# Altium project OZ440-SE100-CAR003.PrjPcb (part 2 of 3)

## Sheet OZ440-SE100-CAR003_sheet5.SchDoc
size A3
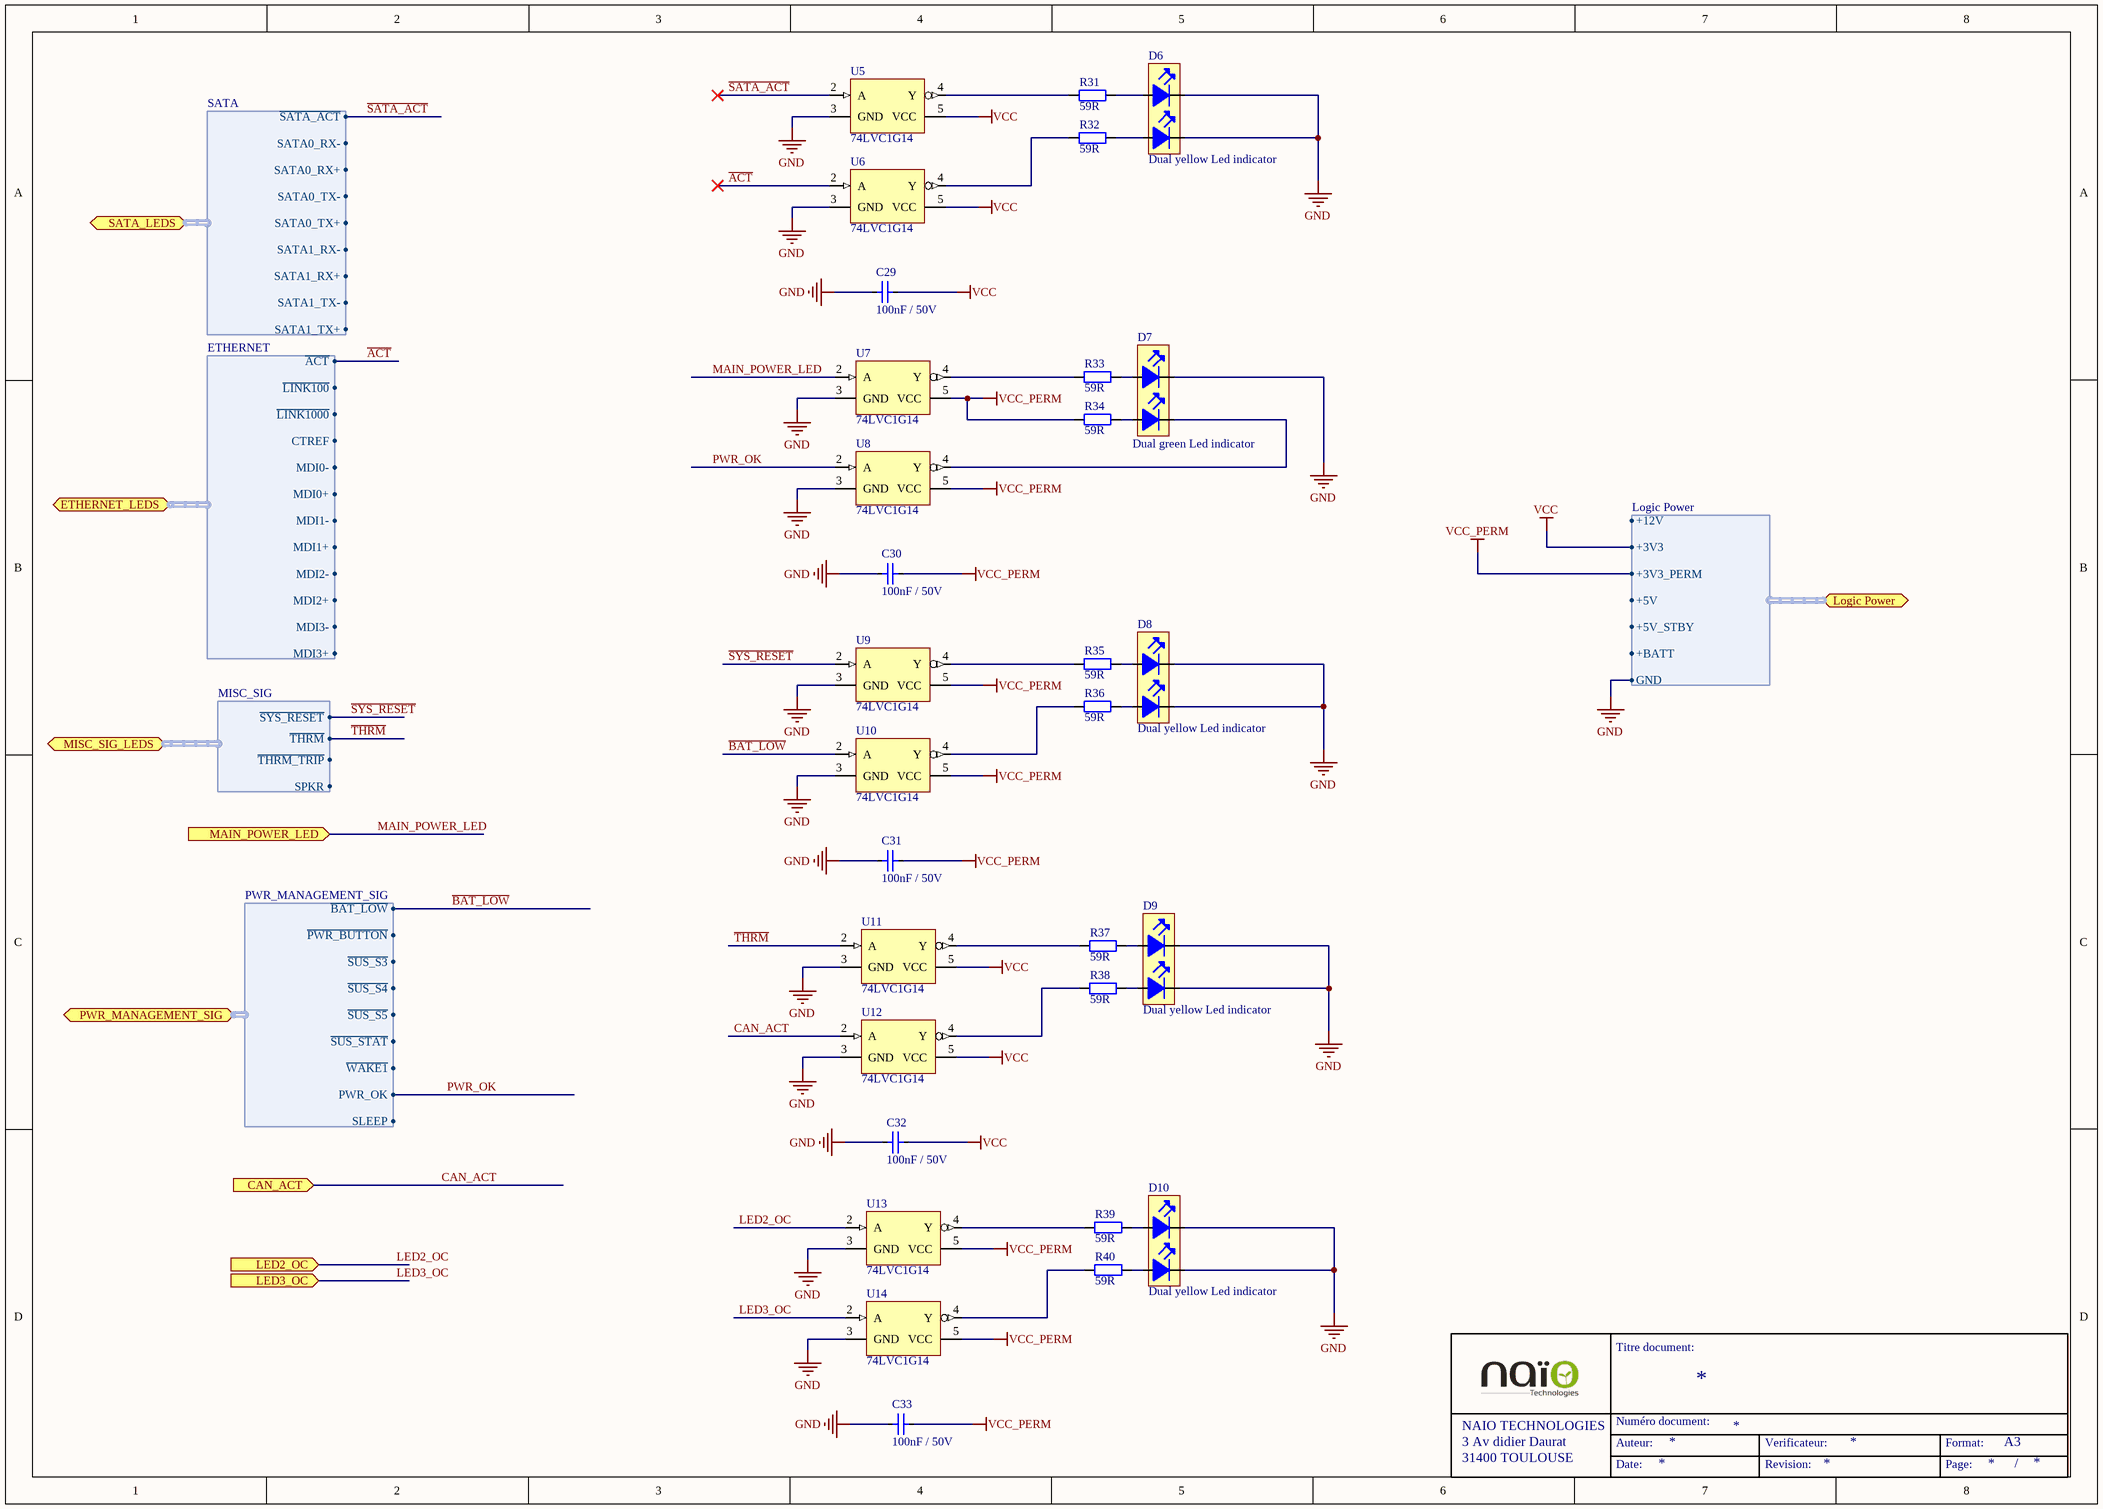
[diagram p4: OZ440-SE100-CAR003_sheet5.SchDoc]

### Parts
C29  Displayed reference: 100nF / 50V  [C0805-STD]  (hidden comment: CAP-SMD)
C30  Displayed reference: 100nF / 50V  [C0805-STD]  (hidden comment: CAP-SMD)
C31  Displayed reference: 100nF / 50V  [C0805-STD]  (hidden comment: CAP-SMD)
C32  Displayed reference: 100nF / 50V  [C0805-STD]  (hidden comment: CAP-SMD)
C33  Displayed reference: 100nF / 50V  [C0805-STD]  (hidden comment: CAP-SMD)
D6  LED_DUAL  [LED_3MM_DUAL]  (value not drawn)
D7  LED_DUAL  [LED_3MM_DUAL]  (value not drawn)
D8  LED_DUAL  [LED_3MM_DUAL]  (value not drawn)
D9  LED_DUAL  [LED_3MM_DUAL]  (value not drawn)
D10  LED_DUAL  [LED_3MM_DUAL]  (value not drawn)
R31  Displayed reference: 59R  [R0805-STD]  (hidden comment: RES-SMD)
R32  Displayed reference: 59R  [R0805-STD]  (hidden comment: RES-SMD)
R33  Displayed reference: 59R  [R0805-STD]  (hidden comment: RES-SMD)
R34  Displayed reference: 59R  [R0805-STD]  (hidden comment: RES-SMD)
R35  Displayed reference: 59R  [R0805-STD]  (hidden comment: RES-SMD)
R36  Displayed reference: 59R  [R0805-STD]  (hidden comment: RES-SMD)
R37  Displayed reference: 59R  [R0805-STD]  (hidden comment: RES-SMD)
R38  Displayed reference: 59R  [R0805-STD]  (hidden comment: RES-SMD)
R39  Displayed reference: 59R  [R0805-STD]  (hidden comment: RES-SMD)
R40  Displayed reference: 59R  [R0805-STD]  (hidden comment: RES-SMD)
U5  Displayed reference: 74LVC1G14  [SOT353-1_5pin-STD]  (hidden comment: 74xxx1G14GW-SOT353-1)
U6  Displayed reference: 74LVC1G14  [SOT353-1_5pin-STD]  (hidden comment: 74xxx1G14GW-SOT353-1)
U7  Displayed reference: 74LVC1G14  [SOT353-1_5pin-STD]  (hidden comment: 74xxx1G14GW-SOT353-1)
U8  Displayed reference: 74LVC1G14  [SOT353-1_5pin-STD]  (hidden comment: 74xxx1G14GW-SOT353-1)
U9  Displayed reference: 74LVC1G14  [SOT353-1_5pin-STD]  (hidden comment: 74xxx1G14GW-SOT353-1)
U10  Displayed reference: 74LVC1G14  [SOT353-1_5pin-STD]  (hidden comment: 74xxx1G14GW-SOT353-1)
U11  Displayed reference: 74LVC1G14  [SOT353-1_5pin-STD]  (hidden comment: 74xxx1G14GW-SOT353-1)
U12  Displayed reference: 74LVC1G14  [SOT353-1_5pin-STD]  (hidden comment: 74xxx1G14GW-SOT353-1)
U13  Displayed reference: 74LVC1G14  [SOT353-1_5pin-STD]  (hidden comment: 74xxx1G14GW-SOT353-1)
U14  Displayed reference: 74LVC1G14  [SOT353-1_5pin-STD]  (hidden comment: 74xxx1G14GW-SOT353-1)

### Ports
CAN_ACT (in), ETHERNET_LEDS (harness ETHERNET), LED2_OC (in), LED3_OC (in), Logic Power (harness Logic Power), MAIN_POWER_LED (in), MISC_SIG_LEDS (harness MISC_SIG), PWR_MANAGEMENT_SIG (harness PWR_MANAGEMENT_SIG), SATA_LEDS (harness SATA)

### Harnesses
SATA: ~{SATA_ACT}, SATA0_RX-, SATA0_RX+, SATA0_TX-, SATA0_TX+, SATA1_RX-, SATA1_RX+, SATA1_TX-, SATA1_TX+
ETHERNET: ~{ACT}, ~{LINK100}, ~{LINK1000}, CTREF, MDI0-, MDI0+, MDI1-, MDI1+, MDI2-, MDI2+, MDI3-, MDI3+
MISC_SIG: ~{SYS_RESET}, ~{THRM}, ~{THRM_TRIP}, SPKR
PWR_MANAGEMENT_SIG: ~{BAT_LOW}, ~{PWR_BUTTON}, ~{SUS_S3}, ~{SUS_S4}, ~{SUS_S5}, ~{SUS_STAT}, ~{WAKE1}, PWR_OK, SLEEP
Logic Power: +12V, +3V3, +3V3_PERM, +5V, +5V_STBY, +BATT, GND

### Nets
+5V: port Logic Power.+5V, port Logic Power.+5V_STBY
GND: C29.1 C30.1 C31.1 C32.1 C33.1 D6.K1 D6.K2 D7.K1 D8.K1 D8.K2 D9.K1 D9.K2 D10.K1 D10.K2 U5.3(GND) U6.3(GND) U7.3(GND) U8.3(GND) U9.3(GND) U10.3(GND) U11.3(GND) U12.3(GND) U13.3(GND) U14.3(GND) ; port Logic Power.GND  [project net Logic_Power.GND]
VCC: C29.2 C32.2 U5.5(VCC) U6.5(VCC) U11.5(VCC) U12.5(VCC) ; port Logic Power.+3V3  [project net +3V3]
VCC_PERM: C30.2 C31.2 C33.2 R34.1 U7.5(VCC) U8.5(VCC) U9.5(VCC) U10.5(VCC) U13.5(VCC) U14.5(VCC) ; port Logic Power.+3V3_PERM  [project net +3V3_PERM]
~{ACT}: U6.2(A) ; port ETHERNET_LEDS.~{ACT}
~{BAT_LOW}: U10.2(A) ; port PWR_MANAGEMENT_SIG.~{BAT_LOW}
~{SATA_ACT}: U5.2(A) ; port SATA_LEDS.~{SATA_ACT}
~{SYS_RESET}: U9.2(A) ; port MISC_SIG_LEDS.~{SYS_RESET}
~{THRM}: U11.2(A) ; port MISC_SIG_LEDS.~{THRM}
CAN_ACT: U12.2(A) ; port CAN_ACT
LED2_OC: U13.2(A) ; port LED2_OC
LED3_OC: U14.2(A) ; port LED3_OC
MAIN_POWER_LED: U7.2(A) ; port MAIN_POWER_LED
PWR_OK: U8.2(A) ; port PWR_MANAGEMENT_SIG.PWR_OK
NetD6_A1: D6.A1 R31.2
NetD6_A2: D6.A2 R32.2
NetD7_A1: D7.A1 R33.2
NetD7_A2: D7.A2 R34.2
NetD7_K2: D7.K2 U8.4(Y)
NetD8_A1: D8.A1 R35.2
NetD8_A2: D8.A2 R36.2
NetD9_A1: D9.A1 R37.2
NetD9_A2: D9.A2 R38.2
NetD10_A1: D10.A1 R39.2
NetD10_A2: D10.A2 R40.2
NetR31_1: R31.1 U5.4(Y)
NetR32_1: R32.1 U6.4(Y)
NetR33_1: R33.1 U7.4(Y)
NetR35_1: R35.1 U9.4(Y)
NetR36_1: R36.1 U10.4(Y)
NetR37_1: R37.1 U11.4(Y)
NetR38_1: R38.1 U12.4(Y)
NetR39_1: R39.1 U13.4(Y)
NetR40_1: R40.1 U14.4(Y)

### Notes on the sheet
- Titre document:
- NAIO TECHNOLOGIES
- 3 Av didier Daurat
- 31400 TOULOUSE
- Auteur:
- Numéro document:
- Verificateur:
- Format:
- A3
- Date:
- Revision:
- Page:
- /

### Library data of the parts
C29-C33 = VJ0805Y104KXAxx: as C4 on sheet OZ440-SE100-CAR003_sheet3; Reference: VJ0805Y104KXAxx; Value: 100nF; Material: X7R; Footprint description: standard Capacitor 0805; Pin Count: 2; helpURL: http://www.vishay.com/docs/45200/highrels.pdf; Supplier 1: Farnell; Supplier Part Number 1: 1612208; Supplier 2: Digi-Key; Supplier Part Number 2: 720-1266-6-ND
D6 D8-D10 = WP934MD/2YD: Dual Yellow led indicator; Manufacturer: KINGBRIGHT; Validated: False; Reference: WP934MD/2YD; Displayed reference: Dual yellow Led indicator; Footprint description: TH 4 pin; Pin Count: 4; Rev: 7.B; helpURL: http://www.mouser.com/ds/2/216/WP934MD-2GD-75217.pdf; Supplier 1: Mouser; Supplier Part Number 1: 604-WP934MD2YD; Supplier 2: Digi-Key; Supplier Part Number 2: WP934MD/2YD-ND
D7 = WP934MD/2GD: Dual green led indicator; Manufacturer: KINGBRIGHT; Validated: False; Reference: WP934MD/2GD; Displayed reference: Dual green Led indicator; Footprint description: TH 4 pin; Pin Count: 4; Rev: 7.B; helpURL: http://www.mouser.com/ds/2/216/WP934MD-2GD-75217.pdf; Supplier 1: Mouser; Supplier Part Number 1: 604-WP934MD/2GD; Supplier 2: Digi-Key; Supplier Part Number 2: 754-1748-ND
R31-R40 = CRCW080559R0FKxx: as R30 on sheet OZ440-SE100-CAR003_sheet4; Reference: CRCW080559R0FKxx; Footprint description: standard 0805 SMD; Pin Count: 2; helpURL: http://www.vishay.com/docs/20035/dcrcwe3.pdf; Supplier 1: Mouser; Supplier Part Number 1: 71-CRCW080559R0FKEA; Supplier 2: Farnell; Supplier Part Number 2: 2138817
U5-U14 = 74LVC1G14GW: smith trigger inverter; Manufacturer: NXP; Max Voltage: 5,5V; Validated: False; Reference: 74LVC1G14GW; Footprint description: SOT353-1, 5 pin; Pin Count: 5; helpURL: http://www.nxp.com/documents/data_sheet/74LVC1G14.pdf; Supplier 1: Farnell; Supplier Part Number 1: 1631687; Supplier 2: Digi-Key; Supplier Part Number 2: 568-2267-1-ND

## Sheet OZ440-SE100-CAR003_sheet6.SchDoc
size A3
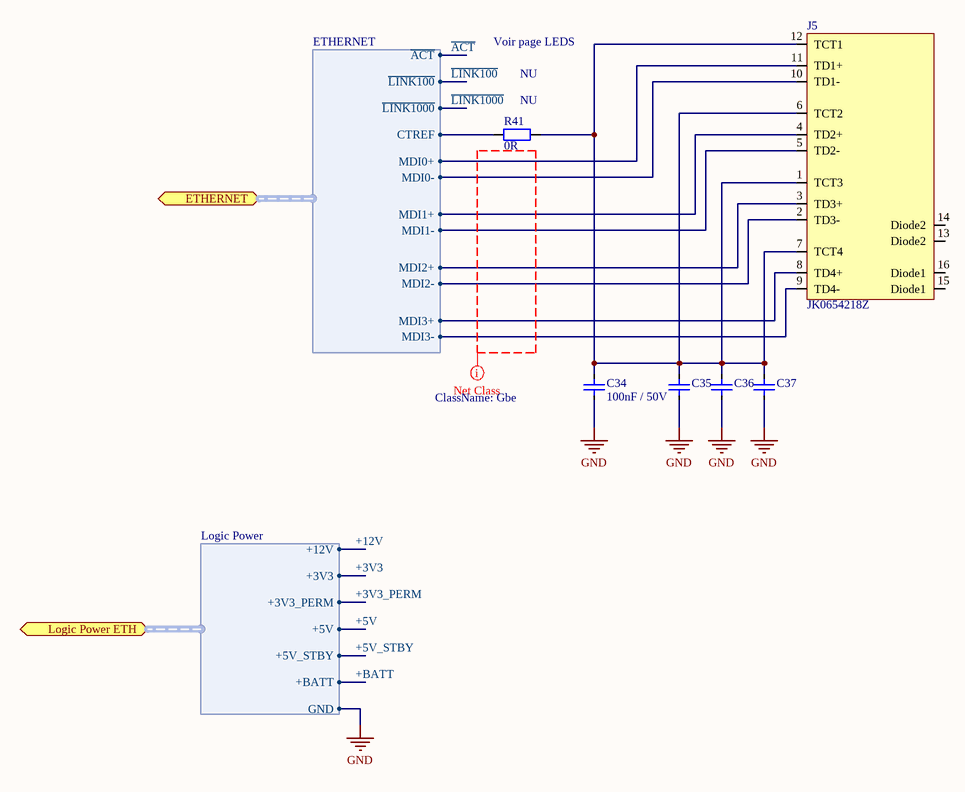
[diagram p5: OZ440-SE100-CAR003_sheet6.SchDoc]

### Parts
C34  Displayed reference: 100nF / 50V  [C0805-STD]  (hidden comment: CAP-SMD)
C35  CAP-SMD  [C0805-STD]  (value not drawn)
C36  CAP-SMD  [C0805-STD]  (value not drawn)
C37  CAP-SMD  [C0805-STD]  (value not drawn)
J5  Displayed reference: JK0654218Z  [TR-SPE-PULSE_JK0654X1XX]  (hidden comment: CONN_GIG_TF-SPE-PULSE_JK0654218Z)
R41  Displayed reference: 0R  [R0805-STD]  (hidden comment: RES-SMD)

### Ports
ETHERNET (harness ETHERNET), Logic Power ETH (harness Logic Power)

### Harnesses
ETHERNET: ~{ACT}, ~{LINK100}, ~{LINK1000}, CTREF, MDI0-, MDI0+, MDI1-, MDI1+, MDI2-, MDI2+, MDI3-, MDI3+
Logic Power: +12V, +3V3, +3V3_PERM, +5V, +5V_STBY, +BATT, GND

### Nets
+5V: port Logic Power ETH.+5V, port Logic Power ETH.+5V_STBY  [also labelled +5V_STBY]
GND: C34.1 C35.1 C36.1 C37.1 ; port Logic Power ETH.GND  [project net Logic_Power.GND]
CTREF: R41.1 ; port ETHERNET.CTREF
MDI0_N: J5.10(TD1-) ; port ETHERNET.MDI0-
MDI0_P: J5.11(TD1+) ; port ETHERNET.MDI0+
MDI1_N: J5.5(TD2-) ; port ETHERNET.MDI1-
MDI1_P: J5.4(TD2+) ; port ETHERNET.MDI1+
MDI2_N: J5.2(TD3-) ; port ETHERNET.MDI2-
MDI2_P: J5.3(TD3+) ; port ETHERNET.MDI2+
MDI3_N: J5.9(TD4-) ; port ETHERNET.MDI3-
MDI3_P: J5.8(TD4+) ; port ETHERNET.MDI3+
NetC34_2: C34.2 C35.2 C36.2 C37.2 J5.1(TCT3) J5.6(TCT2) J5.7(TCT4) J5.12(TCT1) R41.2

Not connected (* = marked no-connect by the designer): J5 13(Diode2) 14(Diode2) 15(Diode1) 16(Diode1)

### Layout directives
net class Gbe: (no net found under the mark)

### Notes on the sheet
- Voir page LEDS
- (near R41) NU
- Titre document:
- NAIO TECHNOLOGIES
- 3 Av didier Daurat
- 31400 TOULOUSE
- Auteur:
- Numéro document:
- Verificateur:
- Format:
- A3
- Date:
- Revision:
- Page:
- /

### Library data of the parts
C34-C37 = VJ0805Y104KXAxx: as C4 on sheet OZ440-SE100-CAR003_sheet3; Reference: VJ0805Y104KXAxx; Value: 100nF; Material: X7R; Footprint description: standard Capacitor 0805; Pin Count: 2; helpURL: http://www.vishay.com/docs/45200/highrels.pdf; Supplier 1: Farnell; Supplier Part Number 1: 1612208; Supplier 2: Digi-Key; Supplier Part Number 2: 720-1266-6-ND
  C35-C37: Displayed reference: 100nF / 50V
J5 = JK0654218Z: Gigabit ethernet xformer with connector; Manufacturer: PULSE; Gain: 1:1; Validated: False; Reference: JK0654218Z; Footprint description: SMD 16 pin; Pin Count: 16; helpURL: http://www.mouser.com/ds/2/336/Pulse%20JK%20Series-198037.pdf; Supplier 1: Mouser; Supplier Part Number 1: 673-JK0654218ZNL
R41 = CRCW08050000Z0xx: 0 Ohm 0805 SMD resistor; Manufacturer: Vishay; Value: 0; Tolerance: 1%; Rated Power: 0.125W; Validated: No; Reference: CRCW08050000Z0xx; Footprint description: standard 0805 SMD; Pin Count: 2; helpURL: http://www.vishay.com/docs/20035/dcrcwe3.pdf; Supplier 1: Farnell; Supplier Part Number 1: 1469846; Supplier 2: Mouser; Supplier Part Number 2: 71-CRCW0805-0-E3

## Sheet OZ440-SE100-CAR003_sheet7.SchDoc
size A3
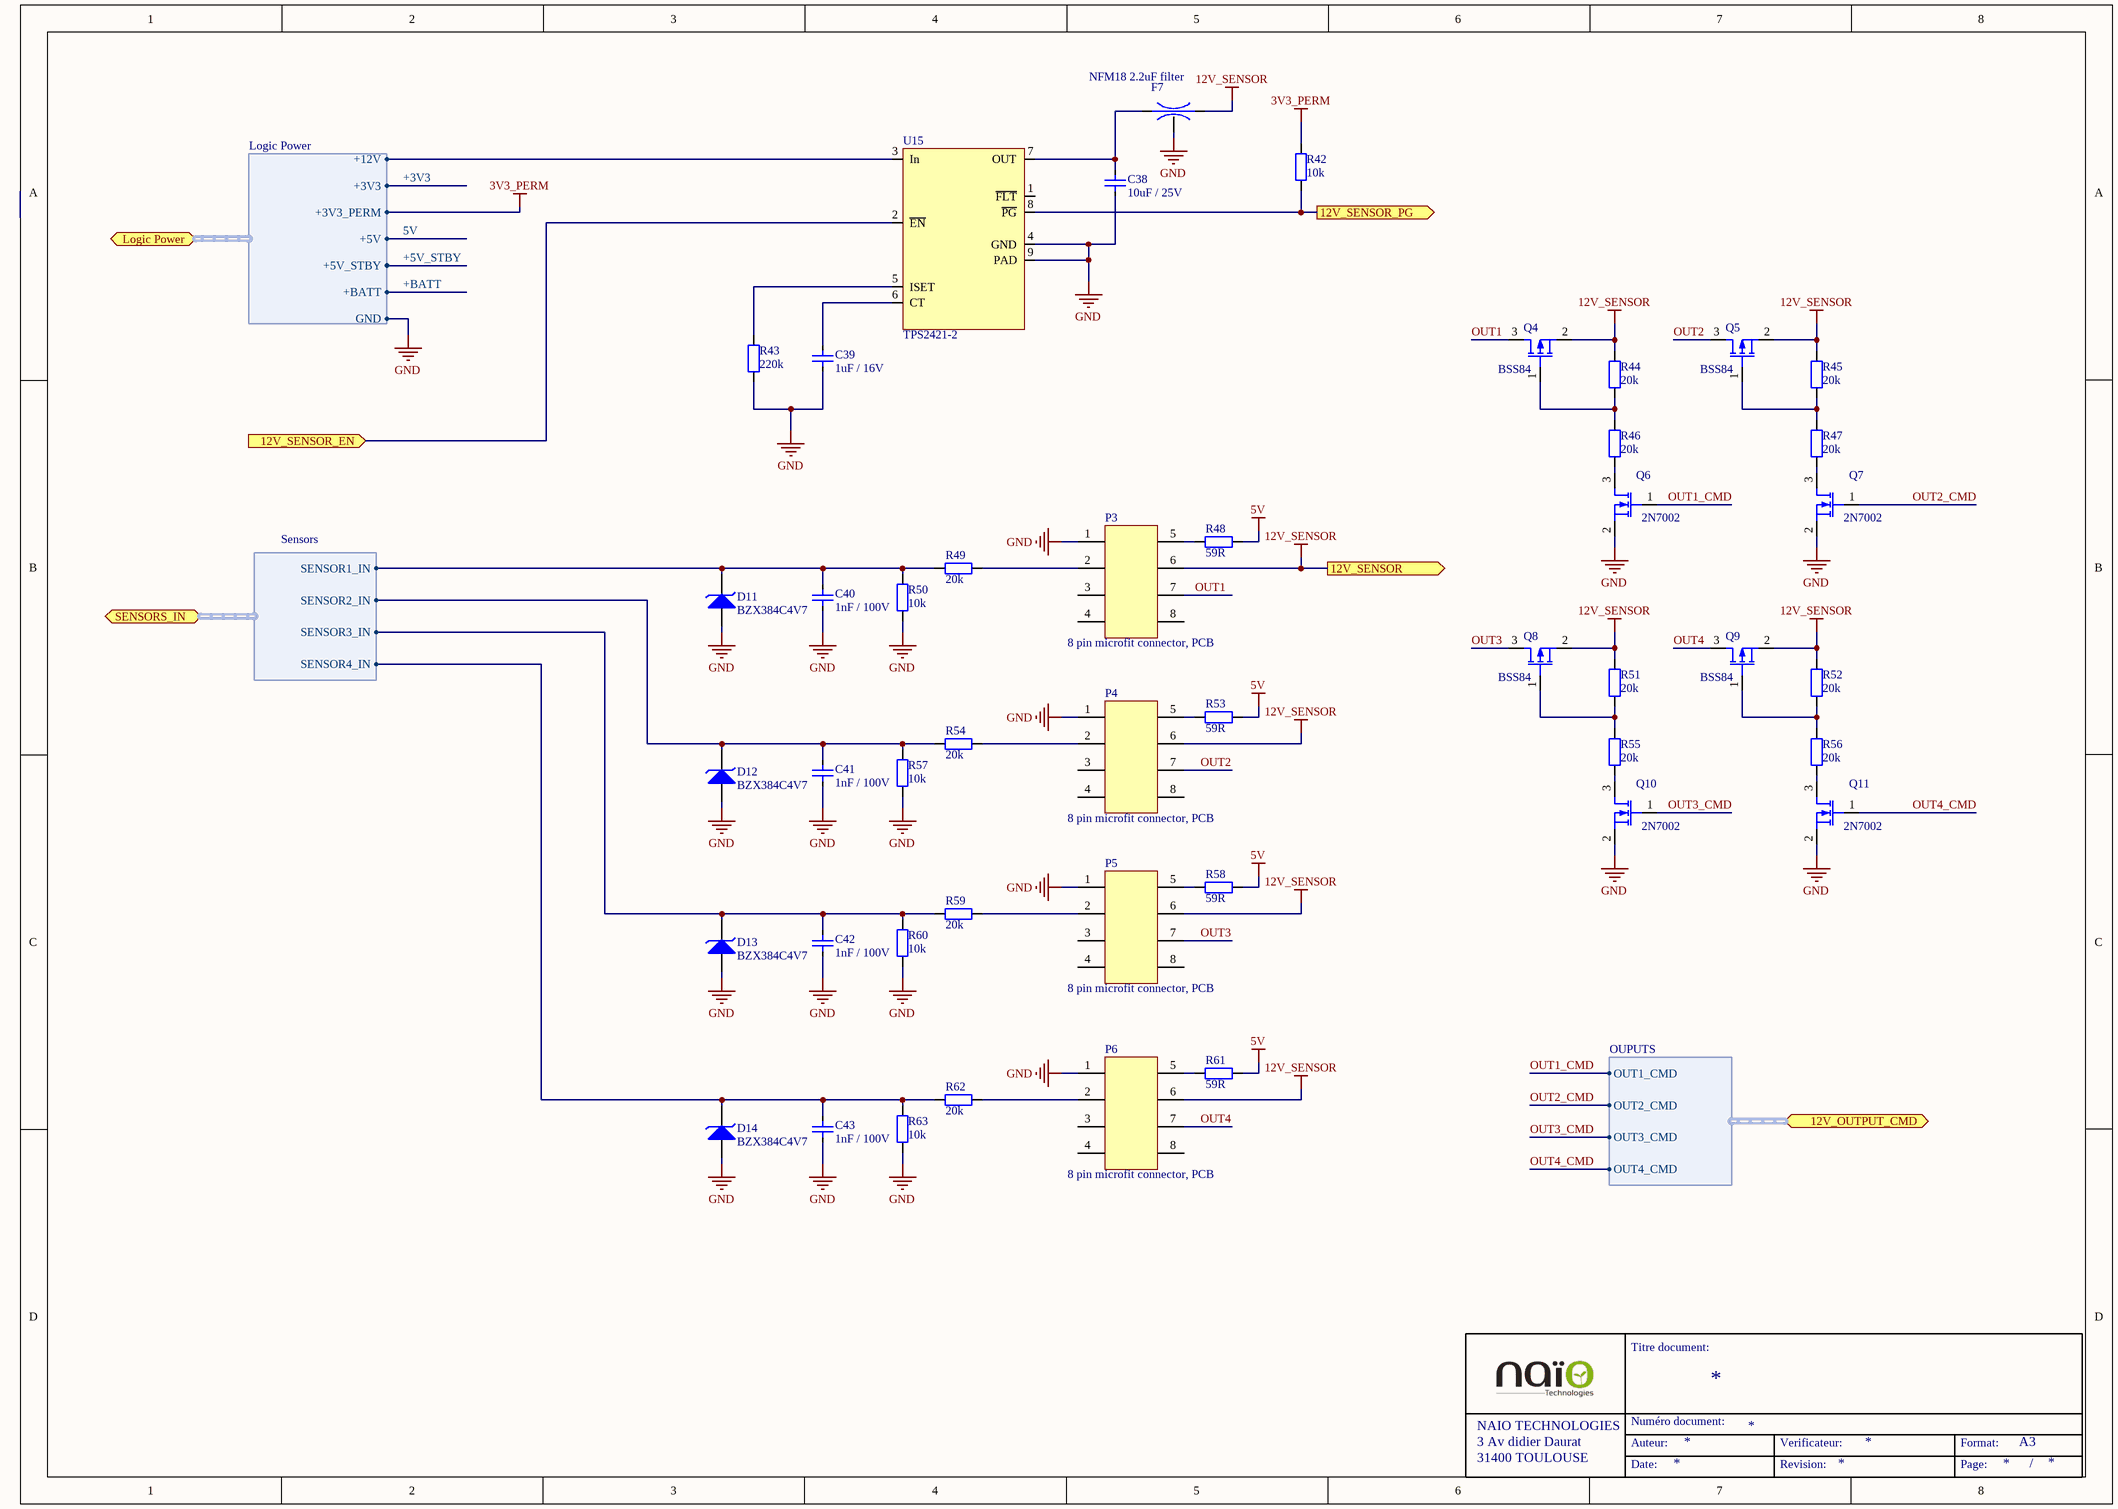
[diagram p6: OZ440-SE100-CAR003_sheet7.SchDoc]

### Parts
C38  Displayed reference: 10uF / 25V  [C1206-STD]  (hidden comment: CAP-SMD)
C39  Displayed reference: 1uF / 16V  [C0805-STD]  (hidden comment: CAP-SMD)
C40  Displayed reference: 1nF / 100V  [C0805-STD]  (hidden comment: CAP-SMD)
C41  Displayed reference: 1nF / 100V  [C0805-STD]  (hidden comment: CAP-SMD)
C42  Displayed reference: 1nF / 100V  [C0805-STD]  (hidden comment: CAP-SMD)
C43  Displayed reference: 1nF / 100V  [C0805-STD]  (hidden comment: CAP-SMD)
D11  Displayed reference: BZX384C4V7  [SOD323-SPE-BZX384]  (hidden comment: DIODE_ZENER-SOD323)
D12  Displayed reference: BZX384C4V7  [SOD323-SPE-BZX384]  (hidden comment: DIODE_ZENER-SOD323)
D13  Displayed reference: BZX384C4V7  [SOD323-SPE-BZX384]  (hidden comment: DIODE_ZENER-SOD323)
D14  Displayed reference: BZX384C4V7  [SOD323-SPE-BZX384]  (hidden comment: DIODE_ZENER-SOD323)
F7  Displayed reference: NFM18 2.2uF filter  [LC_0603-STD]  (hidden comment: LC_FILTER-STD)
P3  Displayed reference: 8 pin microfit connector, PCB  [CONN-SPE_MOLEX_43045-0801]  (hidden comment: CONN-SPE-8P_MOLEX_43045-0801)
P4  Displayed reference: 8 pin microfit connector, PCB  [CONN-SPE_MOLEX_43045-0801]  (hidden comment: CONN-SPE-8P_MOLEX_43045-0801)
P5  Displayed reference: 8 pin microfit connector, PCB  [CONN-SPE_MOLEX_43045-0801]  (hidden comment: CONN-SPE-8P_MOLEX_43045-0801)
P6  Displayed reference: 8 pin microfit connector, PCB  [CONN-SPE_MOLEX_43045-0801]  (hidden comment: CONN-SPE-8P_MOLEX_43045-0801)
Q4  Displayed reference: BSS84  [SOT23-STD]  (hidden comment: BSS84-SOT23)
Q5  Displayed reference: BSS84  [SOT23-STD]  (hidden comment: BSS84-SOT23)
Q6  Displayed reference: 2N7002  [SOT23-SPE-2N7002]  (hidden comment: 2N7002-SMD3P)
Q7  Displayed reference: 2N7002  [SOT23-SPE-2N7002]  (hidden comment: 2N7002-SMD3P)
Q8  Displayed reference: BSS84  [SOT23-STD]  (hidden comment: BSS84-SOT23)
Q9  Displayed reference: BSS84  [SOT23-STD]  (hidden comment: BSS84-SOT23)
Q10  Displayed reference: 2N7002  [SOT23-SPE-2N7002]  (hidden comment: 2N7002-SMD3P)
Q11  Displayed reference: 2N7002  [SOT23-SPE-2N7002]  (hidden comment: 2N7002-SMD3P)
R42  Displayed reference: 10k  [R0805-STD]  (hidden comment: RES-SMD)
R43  Displayed reference: 220k  [R0805-STD]  (hidden comment: RES-SMD)
R44  Displayed reference: 20k  [R0805-STD]  (hidden comment: RES-SMD)
R45  Displayed reference: 20k  [R0805-STD]  (hidden comment: RES-SMD)
R46  Displayed reference: 20k  [R0805-STD]  (hidden comment: RES-SMD)
R47  Displayed reference: 20k  [R0805-STD]  (hidden comment: RES-SMD)
R48  Displayed reference: 59R  [R0805-STD]  (hidden comment: RES-SMD)
R49  Displayed reference: 20k  [R0805-STD]  (hidden comment: RES-SMD)
R50  Displayed reference: 10k  [R0805-STD]  (hidden comment: RES-SMD)
R51  Displayed reference: 20k  [R0805-STD]  (hidden comment: RES-SMD)
R52  Displayed reference: 20k  [R0805-STD]  (hidden comment: RES-SMD)
R53  Displayed reference: 59R  [R0805-STD]  (hidden comment: RES-SMD)
R54  Displayed reference: 20k  [R0805-STD]  (hidden comment: RES-SMD)
R55  Displayed reference: 20k  [R0805-STD]  (hidden comment: RES-SMD)
R56  Displayed reference: 20k  [R0805-STD]  (hidden comment: RES-SMD)
R57  Displayed reference: 10k  [R0805-STD]  (hidden comment: RES-SMD)
R58  Displayed reference: 59R  [R0805-STD]  (hidden comment: RES-SMD)
R59  Displayed reference: 20k  [R0805-STD]  (hidden comment: RES-SMD)
R60  Displayed reference: 10k  [R0805-STD]  (hidden comment: RES-SMD)
R61  Displayed reference: 59R  [R0805-STD]  (hidden comment: RES-SMD)
R62  Displayed reference: 20k  [R0805-STD]  (hidden comment: RES-SMD)
R63  Displayed reference: 10k  [R0805-STD]  (hidden comment: RES-SMD)
U15  Displayed reference: TPS2421-2  [SO8_THERMAL-STD]  (hidden comment: TPS2421-SO8)

### Ports
12V_OUTPUT_CMD (harness OUPUTS), 12V_SENSOR (out), 12V_SENSOR_EN (in), 12V_SENSOR_PG (out), Logic Power (harness Logic Power), SENSORS_IN (harness Sensors)

### Harnesses
Logic Power: +12V, +3V3, +3V3_PERM, +5V, +5V_STBY, +BATT, GND
Sensors: SENSOR1_IN, SENSOR2_IN, SENSOR3_IN, SENSOR4_IN
OUPUTS: OUT4_CMD, OUT3_CMD, OUT2_CMD, OUT1_CMD

### Nets
3V3_PERM: R42.1 ; port Logic Power.+3V3_PERM  [project net +3V3_PERM]
12V_SENSOR: F7.2(B) P3.6 P4.6 P5.6 P6.6 Q4.2(S) Q5.2(S) Q8.2(S) Q9.2(S) R44.2 R45.2 R51.2 R52.2 ; port 12V_SENSOR
+5V_STBY: R48.2 R53.2 R58.2 R61.2 ; port Logic Power.+5V, port Logic Power.+5V_STBY  [also labelled 5V]  [project net +5V]
GND: C38.1 C39.1 C40.1 C41.1 C42.1 C43.1 D11.A D12.A D13.A D14.A F7.3(G) P3.1 P4.1 P5.1 P6.1 Q6.2(S) Q7.2(S) Q10.2(S) Q11.2(S) R43.1 R50.1 R57.1 R60.1 R63.1 U15.4(GND) U15.9(PAD) ; port Logic Power.GND  [project net Logic_Power.GND]
12V_SENSOR_EN: U15.2(~{EN}) ; port 12V_SENSOR_EN
+12V: U15.3(In) ; port Logic Power.+12V
OUT1: P3.7 Q4.3(D)
OUT1_CMD: Q6.1(G) ; port 12V_OUTPUT_CMD.OUT1_CMD
OUT2: P4.7 Q5.3(D)
OUT2_CMD: Q7.1(G) ; port 12V_OUTPUT_CMD.OUT2_CMD
OUT3: P5.7 Q8.3(D)
OUT3_CMD: Q10.1(G) ; port 12V_OUTPUT_CMD.OUT3_CMD
OUT4: P6.7 Q9.3(D)
OUT4_CMD: Q11.1(G) ; port 12V_OUTPUT_CMD.OUT4_CMD
SENSOR1_IN: C40.2 D11.K R49.1 R50.2 ; port SENSORS_IN.SENSOR1_IN
SENSOR2_IN: C41.2 D12.K R54.1 R57.2 ; port SENSORS_IN.SENSOR2_IN
SENSOR3_IN: C42.2 D13.K R59.1 R60.2 ; port SENSORS_IN.SENSOR3_IN
SENSOR4_IN: C43.2 D14.K R62.1 R63.2 ; port SENSORS_IN.SENSOR4_IN
NetC38_2: C38.2 F7.1(A) U15.7(OUT)
NetC39_2: C39.2 U15.6(CT)
NetP3_2: P3.2 R49.2
NetP3_5: P3.5 R48.1
NetP4_2: P4.2 R54.2
NetP4_5: P4.5 R53.1
NetP5_2: P5.2 R59.2
NetP5_5: P5.5 R58.1
NetP6_2: P6.2 R62.2
NetP6_5: P6.5 R61.1
NetQ4_1: Q4.1(G) R44.1 R46.2
NetQ5_1: Q5.1(G) R45.1 R47.2
NetQ6_3: Q6.3(D) R46.1
NetQ7_3: Q7.3(D) R47.1
NetQ8_1: Q8.1(G) R51.1 R55.2
NetQ9_1: Q9.1(G) R52.1 R56.2
NetQ10_3: Q10.3(D) R55.1
NetQ11_3: Q11.3(D) R56.1
NetR42_2: R42.2 U15.8(~{PG}) ; port 12V_SENSOR_PG
NetR43_2: R43.2 U15.5(ISET)

Not connected (* = marked no-connect by the designer): P3 3 4(7) 8; P4 3 4(7) 8; P5 3 4(7) 8; P6 3 4(7) 8; U15 1(~{FLT})

### Notes on the sheet
- Titre document:
- NAIO TECHNOLOGIES
- 3 Av didier Daurat
- 31400 TOULOUSE
- Auteur:
- Numéro document:
- Verificateur:
- Format:
- A3
- Date:
- Revision:
- Page:
- /

### Library data of the parts
C38 = C1206C106K3RACxx: 1206 10uF / 25V X7R ceramic capacitor; Manufacturer: Kemet; Max Voltage: 25; Tolerance: +/- 10%; Validated: N; Reference: C1206C106K3RACxx; Value: 10uF; Material: X7R; Footprint description: standard Capacitor 1206; Pin Count: 2; helpURL: http://www.farnell.com/datasheets/1444528.pdf; Supplier 1: Farnell; Supplier Part Number 1: 2118134; Supplier 2: Digi-Key; Supplier Part Number 2: 399-7442-1-ND
C39 = C0805C105K4RACxx: 0805 1uF / 16V X7R ceramic capacitor; Manufacturer: Kemet; Max Voltage: 16; Tolerance: +/- 10%; Validated: N; Reference: C0805C105K4RACxx; Value: 1uF; Material: X7R; Footprint description: standard Capacitor 0805; Pin Count: 2; helpURL: http://www.farnell.com/datasheets/40863.pdf; Supplier 1: Farnell; Supplier Part Number 1: 9227792; Supplier 2: Digi-Key; Supplier Part Number 2: 399-6930-1-ND
C40-C43 = VJ0805Y102KXBxx: 0805 1nF / 100V X7R ceramic capacitor; Manufacturer: vishay; Max Voltage: 50; Tolerance: +/- 10%; Validated: N; Reference: VJ0805Y102KXBxx; Value: 1nF; Material: X7R; Footprint description: standard Capacitor 0805; Pin Count: 2; helpURL: http://www.vishay.com/docs/45200/highrels.pdf; Supplier 1: Farnell; Supplier Part Number 1: 1555112; Supplier 2: Digi-Key; Supplier Part Number 2: 720-1264-1-ND
D11-D14 = BZX384C4V7: 4.7V zener diode; Manufacturer: VISHAY; Rated Power: 200mW; Validated: FALSE; Reference: BZX384C4V7; component type: Zener diode; Value: 4.7V; Footprint description: SOD323; Pin Count: 2; Rev: 1.9; helpURL: http://www.vishay.com/docs/85764/bzx384.pdf; Supplier 1: Mouser; Supplier Part Number 1: 771-BZX384-C4V7115; Supplier 2: Farnell; Supplier Part Number 2: 8735700
F7 = NFM18PC225B0J3: 2A LC filter; Manufacturer: MURATA; Max Voltage: 6.3; Frequency band: 0-20Mhz; Validated: False; Reference: NFM18PC225B0J3; Max Current: 2A; Footprint description: standard 0603 filter package; Pin Count: 3; Rev: 2/11/2011; helpURL: http://www.murata.com/products/emc/application/pdf/EMIAPDCE_2.pdf; Supplier 1: Digi-Key; Supplier Part Number 1: NFM18PC225B0J3D-ND; Supplier 2: Mouser; Supplier Part Number 2: 81-NFM18PC225B0J3D
P3-P6 = 43045-0801: 8 pin Microfit connector; Manufacturer: Molex; Max Voltage: 600V; Max Current: 5A; Validated: False; Reference: 43045-0801; Footprint description: 8 pin SMT connector RA, TH; Pin Count: 8; Rev: F; helpURL: http://www.molex.com/pdm_docs/sd/430450801_sd.pdf; Supplier 1: Mouser; Supplier Part Number 1: 538-43045-0801; Supplier 2: Digi-Key; Supplier Part Number 2: WM3253-ND
Q4 Q5 Q8 Q9 = BSS84: P-Channel Enhancement Mode Field Effect Transistor; Manufacturer: FAIRCHILD; Max Voltage: 50V; Max Current: 0,13A; Rated Power: 0,36W; Validated: False; Reference: BSS84; component type: PMOS; Footprint description: SOT23; Pin Count: 3; Rev: 1; helpURL: http://www.fairchildsemi.com/ds/BS/BSS84.pdf; Supplier 1: Mouser; Supplier Part Number 1: 512-BSS84; Supplier 2: Farnell; Supplier Part Number 2: 1094997
Q6 Q7 Q10 Q11 = 2N7002: N-Channel Enhancement Mode Field Effect Transistor; Manufacturer: FAIRCHILD; Max Voltage: 60 V; Max Current: 0,4 A; Rated Power: 0,2 W; Validated: False; Reference: 2N7002; component type: NMOS; Footprint description: SOT23; Pin Count: 3; Rev: A1; helpURL: http://www.fairchildsemi.com/ds/2N/2N7000.pdf; Supplier 1: Farnell; Supplier Part Number 1: 9845313; Supplier 2: Newark; Supplier Part Number 2: 58K9651
R42 R50 R57 R60 R63 = CRCW080510K0FKxx: 10k Ohm 0805 SMD resistor; Manufacturer: Vishay; Value: 10 000; Tolerance: 1 %; Rated Power: 0,125 W; Validated: No; Reference: CRCW080510K0FKxx; Footprint description: standard 0805 SMD; Pin Count: 2; helpURL: http://www.vishay.com/docs/20035/dcrcwe3.pdf; Supplier 1: Farnell; Supplier Part Number 1: 1469856; Supplier 2: Mouser; Supplier Part Number 2: 71-CRCW0805-10K-E3
R43 = CRCW0805220KFKxx: 220k Ohm 0805 SMD resistor; Manufacturer: Vishay; Value: 220 000; Tolerance: 1 %; Rated Power: 0,125 W; Validated: No; Reference: CRCW0805220KFKxx; Footprint description: standard 0805 SMD; Pin Count: 2; helpURL: http://www.vishay.com/docs/20035/dcrcwe3.pdf; Supplier 1: Farnell; Supplier Part Number 1: 1469653; Supplier 2: Mouser; Supplier Part Number 2: 71-CRCW0805220KFKEA
R44-R47 R49 R51 R52 R54-R56 R59 R62 = CRCW080520K0FKxx: 20k Ohm 0805 SMD resistor; Manufacturer: Vishay; Value: 20 000; Tolerance: 1 %; Rated Power: 0,125 W; Validated: No; Reference: CRCW080520K0FKxx; Footprint description: standard 0805 SMD; Pin Count: 2; helpURL: http://www.vishay.com/docs/20035/dcrcwe3.pdf; Supplier 1: Farnell; Supplier Part Number 1: 1469893; Supplier 2: Mouser; Supplier Part Number 2: 71-CRCW0805-20K-E3
R48 R53 R58 R61 = CRCW080559R0FKxx: 59 Ohm 0805 SMD resistor; Manufacturer: Vishay; Value: 59; Tolerance: 1 %; Rated Power: 0.125 W; Validated: No; Reference: CRCW080559R0FKxx; Footprint description: standard 0805 SMD; Pin Count: 2; helpURL: http://www.vishay.com/docs/20035/dcrcwe3.pdf; Supplier 1: Mouser; Supplier Part Number 1: 71-CRCW080559R0FKEA; Supplier 2: Farnell; Supplier Part Number 2: 2138817
U15 = TPS2421-2DDA: 20V-5A Hot plug controller with integrated FET, auto retry; Manufacturer: TI; Max Voltage: 20V; Max Current: 5A; Validated: False; Reference: TPS2421-2DDA; Footprint description: SO8 with thermal PAD; Pin Count: 8; Rev: 01/14; helpURL: http://www.ti.com/lit/ds/symlink/tps2421-1.pdf; Supplier 1: Mouser; Supplier Part Number 1: 595-TPS2421-2DDA; Supplier 2: Farnell; Supplier Part Number 2: 2323674

## Sheet OZ440-SE100-CAR003_sheet8.SchDoc
size A3
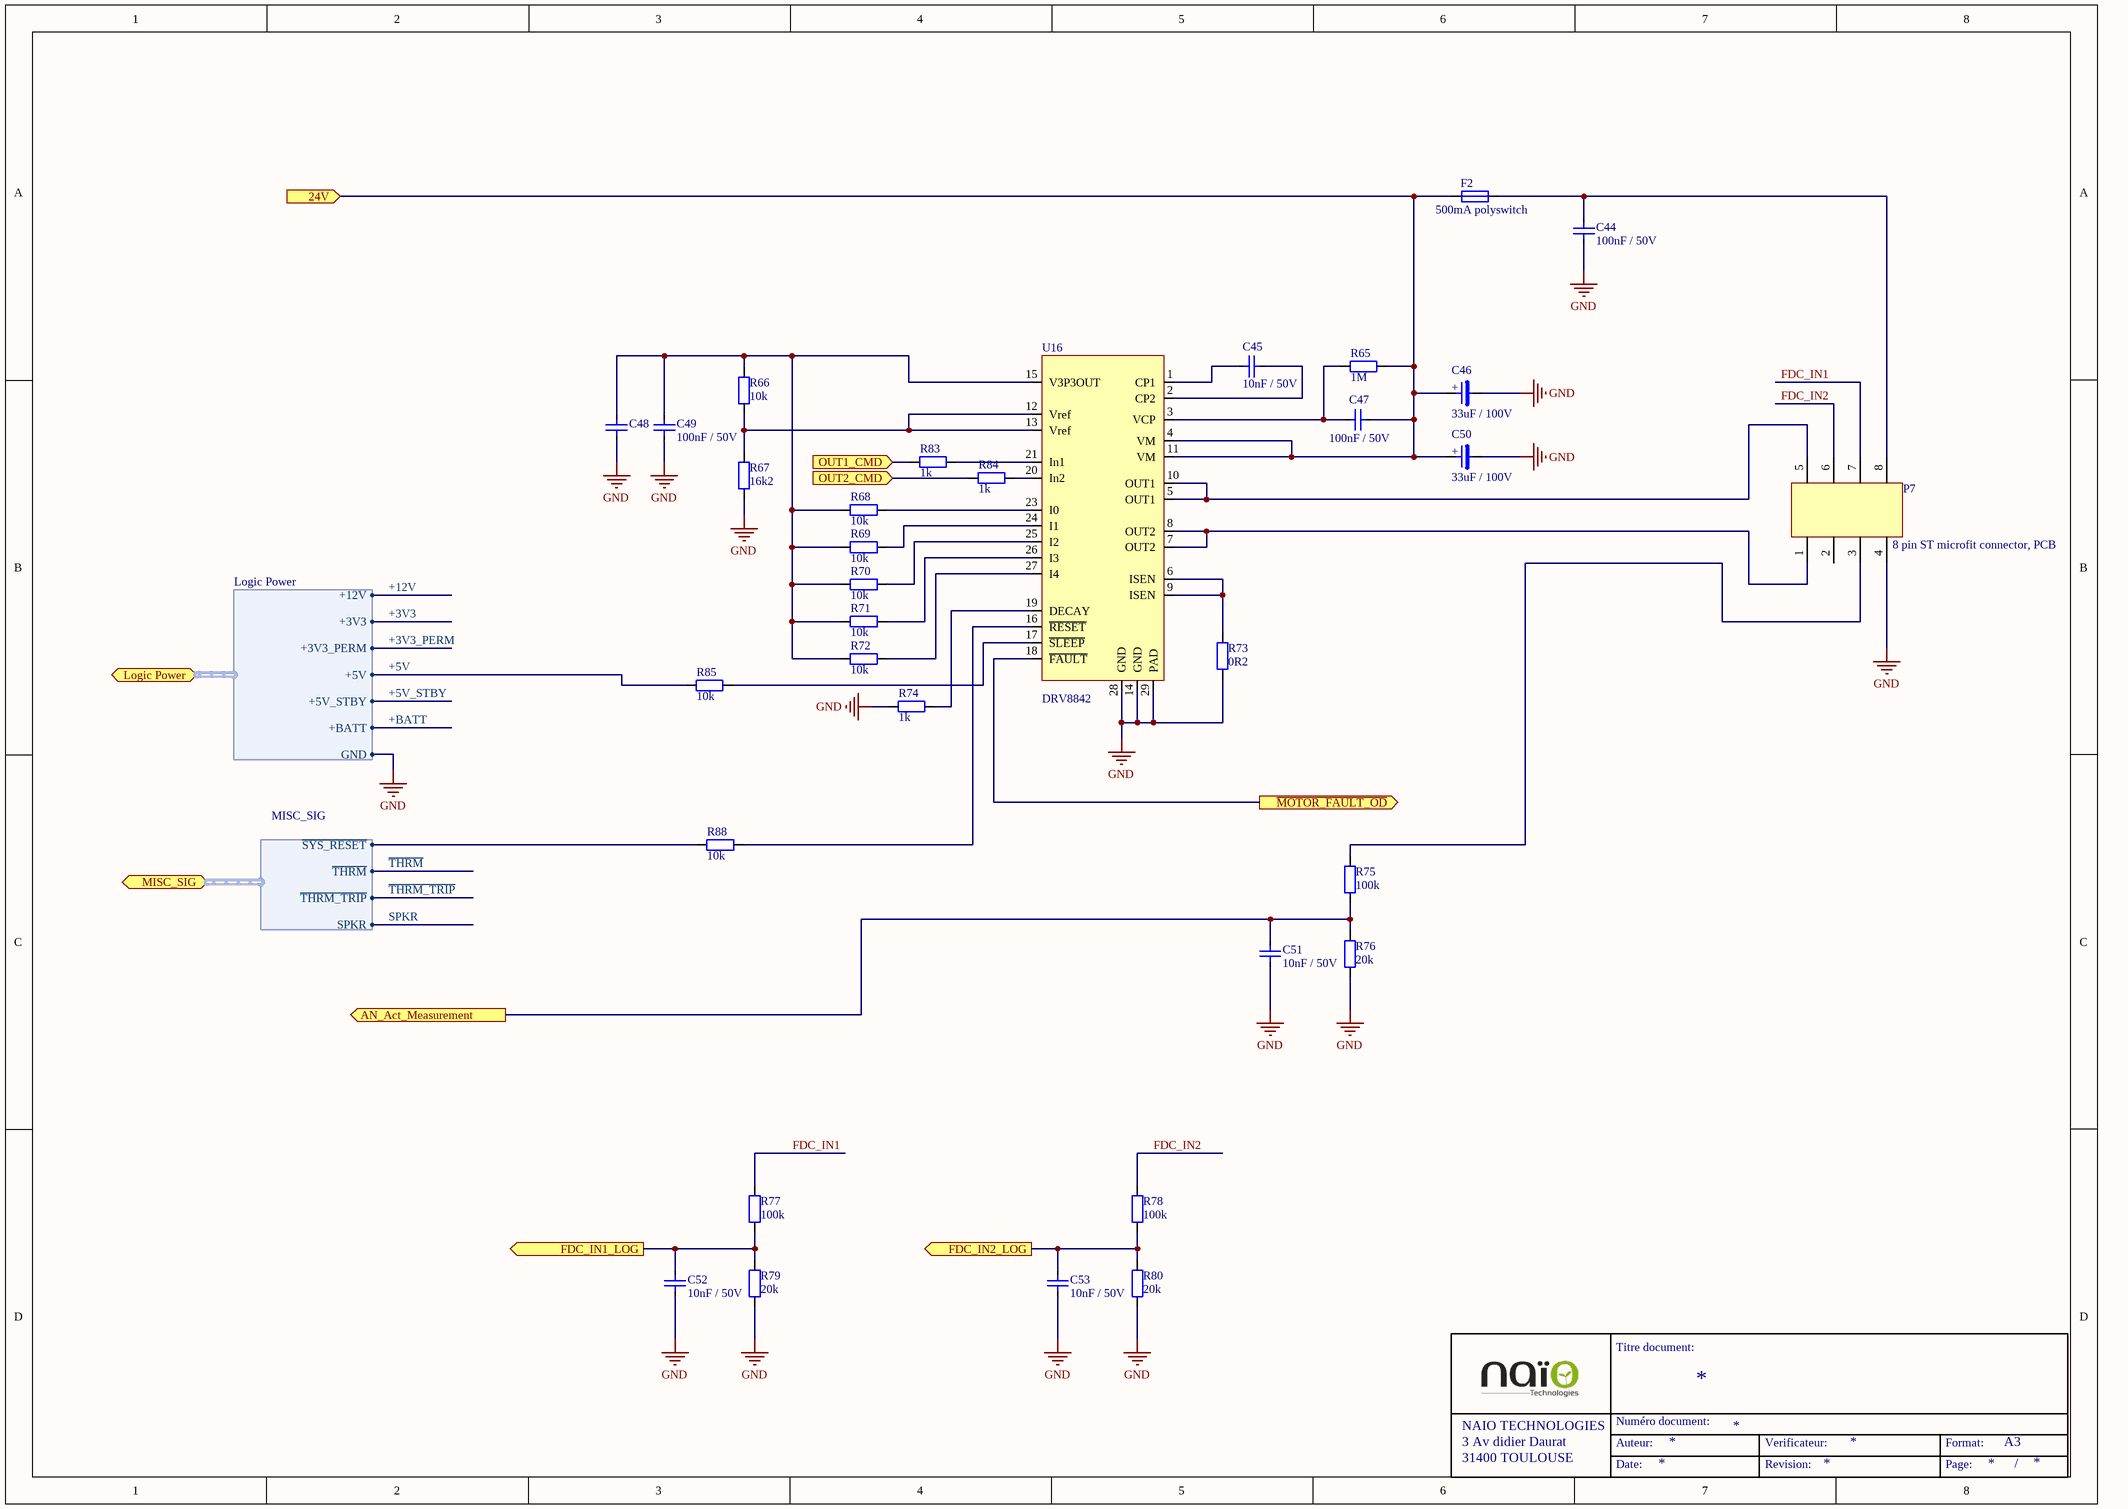
[diagram p7: OZ440-SE100-CAR003_sheet8.SchDoc]

### Parts
C44  Displayed reference: 100nF / 50V  [C0805-STD]  (hidden comment: CAP-SMD)
C45  Displayed reference: 10nF / 50V  [C0805-STD]  (hidden comment: CAP-SMD)
C46  Displayed reference: 33uF / 100V  [CAP-ELECTRO-SMD_SIZE_G]  (hidden comment: CAP-POL-SMD)
C47  Displayed reference: 100nF / 50V  [C0805-STD]  (hidden comment: CAP-SMD)
C48  CAP-SMD  [C0805-STD]  (value not drawn)
C49  Displayed reference: 100nF / 50V  [C0805-STD]  (hidden comment: CAP-SMD)
C50  Displayed reference: 33uF / 100V  [CAP-ELECTRO-SMD_SIZE_G]  (hidden comment: CAP-POL-SMD)
C51  Displayed reference: 10nF / 50V  [C0805-STD]  (hidden comment: CAP-SMD)
C52  Displayed reference: 10nF / 50V  [C0805-STD]  (hidden comment: CAP-SMD)
C53  Displayed reference: 10nF / 50V  [C0805-STD]  (hidden comment: CAP-SMD)
F2  Displayed reference: 500mA polyswitch  [R0805-STD]  (hidden comment: FUSE-SMD)
P7  Displayed reference: 8 pin ST microfit connector, PCB  [CONN-SPE_MOLEX_43045-0812]  (hidden comment: CONN-SPE-8P_MOLEX_43045-0801)
R65  Displayed reference: 1M  [R0805-STD]  (hidden comment: RES-SMD)
R66  Displayed reference: 10k  [R0805-STD]  (hidden comment: RES-SMD)
R67  Displayed reference: 16k2  [R0805-STD]  (hidden comment: RES-SMD)
R68  Displayed reference: 10k  [R0805-STD]  (hidden comment: RES-SMD)
R69  Displayed reference: 10k  [R0805-STD]  (hidden comment: RES-SMD)
R70  Displayed reference: 10k  [R0805-STD]  (hidden comment: RES-SMD)
R71  Displayed reference: 10k  [R0805-STD]  (hidden comment: RES-SMD)
R72  Displayed reference: 10k  [R0805-STD]  (hidden comment: RES-SMD)
R73  Displayed reference: 0R2  [R2512-STD]  (hidden comment: RES-SMD)
R74  Displayed reference: 1k  [R0805-STD]  (hidden comment: RES-SMD)
R75  Displayed reference: 100k  [R0805-STD]  (hidden comment: RES-SMD)
R76  Displayed reference: 20k  [R0805-STD]  (hidden comment: RES-SMD)
R77  Displayed reference: 100k  [R0805-STD]  (hidden comment: RES-SMD)
R78  Displayed reference: 100k  [R0805-STD]  (hidden comment: RES-SMD)
R79  Displayed reference: 20k  [R0805-STD]  (hidden comment: RES-SMD)
R80  Displayed reference: 20k  [R0805-STD]  (hidden comment: RES-SMD)
R83  Displayed reference: 1k  [R0805-STD]  (hidden comment: RES-SMD)
R84  Displayed reference: 1k  [R0805-STD]  (hidden comment: RES-SMD)
R85  Displayed reference: 10k  [R0805-STD]  (hidden comment: RES-SMD)
R88  Displayed reference: 10k  [R0805-STD]  (hidden comment: RES-SMD)
U16  Displayed reference: DRV8842  [TSSOP28-SPE-DRV8842]  (hidden comment: DRV8842-TSSOP28)

### Ports
24V (in), AN_Act_Measurement (out), FDC_IN1_LOG (out), FDC_IN2_LOG (out), Logic Power (harness Logic Power), MISC_SIG (harness MISC_SIG), OUT1_CMD (in), OUT2_CMD (in), ~{MOTOR_FAULT_OD} (out)

### Harnesses
MISC_SIG: ~{SYS_RESET}, ~{THRM}, ~{THRM_TRIP}, SPKR
Logic Power: +12V, +3V3, +3V3_PERM, +5V, +5V_STBY, +BATT, GND

### Nets
+5V: R85.1 ; port Logic Power.+5V, port Logic Power.+5V_STBY  [also labelled +5V_STBY]
GND: C44.1 C46.2 C48.1 C49.1 C50.2 C51.1 C52.1 C53.1 P7.4 R67.1 R73.1 R74.1 R76.1 R79.1 R80.1 U16.14(GND) U16.28(GND) U16.29(PAD) ; port Logic Power.GND  [project net Logic_Power.GND]
24V_POWER: C46.1 C47.2 C50.1 F2.1 R65.2 U16.4(VM) U16.11(VM) ; port 24V
~{MOTOR_FAULT_OD}: U16.18(~{FAULT}) ; port ~{MOTOR_FAULT_OD}
~{SYS_RESET}: R88.1 ; port MISC_SIG.~{SYS_RESET}
FDC_IN1: P7.7 R77.2
FDC_IN2: P7.6 R78.2
NetC44_2: C44.2 F2.2 P7.8
NetC45_1: C45.1 U16.1(CP1)
NetC45_2: C45.2 U16.2(CP2)
NetC47_1: C47.1 R65.1 U16.3(VCP)
NetC48_2: C48.2 C49.2 R66.1 R68.1 R69.1 R70.1 R71.1 R72.1 U16.15(V3P3OUT)
NetC51_2: C51.2 R75.1 R76.2 ; port AN_Act_Measurement
NetC52_2: C52.2 R77.1 R79.2 ; port FDC_IN1_LOG
NetC53_2: C53.2 R78.1 R80.2 ; port FDC_IN2_LOG
NetP7_1: P7.1 U16.7(OUT2) U16.8(OUT2)
NetP7_3: P7.3 R75.2
NetP7_5: P7.5 U16.5(OUT1) U16.10(OUT1)
NetR66_2: R66.2 R67.2 U16.12(Vref) U16.13(Vref)
NetR68_2: R68.2 U16.23(I0)
NetR69_2: R69.2 U16.24(I1)
NetR70_2: R70.2 U16.25(I2)
NetR71_2: R71.2 U16.26(I3)
NetR72_2: R72.2 U16.27(I4)
NetR73_2: R73.2 U16.6(ISEN) U16.9(ISEN)
NetR74_2: R74.2 U16.19(DECAY)
NetR83_1: R83.1 ; port OUT1_CMD
NetR83_2: R83.2 U16.21(In1)
NetR84_1: R84.1 ; port OUT2_CMD
NetR84_2: R84.2 U16.20(In2)
NetR85_2: R85.2 U16.17(~{SLEEP})
NetR88_2: R88.2 U16.16(~{RESET})

Not connected (* = marked no-connect by the designer): P7 2

### Notes on the sheet
- Titre document:
- NAIO TECHNOLOGIES
- 3 Av didier Daurat
- 31400 TOULOUSE
- Auteur:
- Numéro document:
- Verificateur:
- Format:
- A3
- Date:
- Revision:
- Page:
- /
- (in symbol EEE2AA330P) +

### Library data of the parts
C44 C47-C49 = VJ0805Y104KXAxx: 0805 100nF / 50V  X7R ceramic capacitor; Manufacturer: vishay; Max Voltage: 50; Tolerance: +/- 10%; Validated: N; Reference: VJ0805Y104KXAxx; Value: 100nF; Material: X7R; Footprint description: standard Capacitor 0805; Pin Count: 2; helpURL: http://www.vishay.com/docs/45200/highrels.pdf; Supplier 1: Farnell; Supplier Part Number 1: 1612208; Supplier 2: Digi-Key; Supplier Part Number 2: 720-1266-6-ND
  C48: Displayed reference: 100nF / 50V
C45 C51-C53 = VJ0805Y103KXAxx: 0805 10nF / 50V X7R ceramic capacitor; Manufacturer: vishay; Max Voltage: 50; Tolerance: +/- 10%; Validated: N; Reference: VJ0805Y103KXAxx; Value: 10nF; Material: X7R; Footprint description: standard Capacitor 0805; Pin Count: 2; helpURL: http://www.vishay.com/docs/45200/highrels.pdf; Supplier 1: Farnell; Supplier Part Number 1: 1650952; Supplier 2: Digi-Key; Supplier Part Number 2: BC1293CT-ND
C46 C50 = EEE2AA330P: 33uF / 100V Aluminium capacitor SMD; Manufacturer: Panasonic; Max Current: 0.05; Reference: EEE2AA330P; Value: 33uF; Max Voltage: 100V; Material: Aluminium; Footprint description: 10mmx10mm; Pin Count: 2; helpURL: http://industrial.panasonic.com/www-data/pdf/ABA0000/ABA0000CE2.pdf; Supplier 1: Farnell; Supplier Part Number 1: 1899628; Supplier 2: Mouser; Supplier Part Number 2: 667-EEE-2AA330P
F2 = MF-PSMF050X-2: 0805 500mA resettable fuse; Manufacturer: BOURNS; Validated: False; Reference: MF-PSMF050X-2; Max Current: 500mA; Pin Count: 2; helpURL: http://www.farnell.com/datasheets/1442129.pdf; Supplier 1: Farnell; Supplier Part Number 1: 1294876; Supplier 2: Mouser; Supplier Part Number 2: 652-MF-PSMF050X-2
P7 = 43045-0812: 8 pin Microfit connector; Manufacturer: Molex; Max Voltage: 600V; Max Current: 5A; Reference: 43045-0812; Footprint description: 8 pin SMT connector ST, TH; Pin Count: 8; Rev: G; helpURL: http://www.molex.com/pdm_docs/sd/430450812_sd.pdf
R65 = CRCW08051M00FKxx: 1Mohm 1% 0805 SMD resistor; Manufacturer: Vishay; Value: 1000000; Rated Power: 0.125W; Validated: False; Reference: CRCW08051M00FKxx; Tolerance: 1%; Footprint description: standard 0805 SMD; Pin Count: 2; helpURL: http://www.vishay.com/docs/20035/dcrcwe3.pdf; Supplier 1: Farnell; Supplier Part Number 1: 2413580; Supplier 2: Mouser; Supplier Part Number 2: 71-CRCW08051M00FKEB
R66 R68-R72 R85 R88 = CRCW080510K0FKxx: as R42 on sheet OZ440-SE100-CAR003_sheet7; Reference: CRCW080510K0FKxx; Footprint description: standard 0805 SMD; Pin Count: 2; helpURL: http://www.vishay.com/docs/20035/dcrcwe3.pdf; Supplier 1: Farnell; Supplier Part Number 1: 1469856; Supplier 2: Mouser; Supplier Part Number 2: 71-CRCW0805-10K-E3
R67 = CRCW080516K2FKxx: 16k2 Ohm 0805 SMD resistor; Manufacturer: Vishay; Value: 16200; Tolerance: 1%; Rated Power: 0.125W; Validated: No; Reference: CRCW080516K2FKxx; Footprint description: standard 0805 SMD; Pin Count: 2; helpURL: http://www.vishay.com/docs/20035/dcrcwe3.pdf; Supplier 1: Mouser; Supplier Part Number 1: 71-CRCW0805-16.2K-E3; Supplier 2: Farnell; Supplier Part Number 2: 1469878
R73 = CRM2512-JX-R200ELF: 0.2R 1% 2512 SMD resistor; Manufacturer: Bourns; Value: 0.2; Rated Power: 2W; Validated: False; Reference: CRM2512-JX-R200ELF; Tolerance: 1%; Footprint description: standard 2512 SMD; Pin Count: 2; helpURL: http://www.mouser.com/ds/2/54/CRM-335960.pdf; Supplier 1: Farnell; Supplier Part Number 1: 2328177; Supplier 2: Mouser; Supplier Part Number 2: 652-CRM2512JXR200ELF
R74 R83 R84 = CRCW08051K00FKxx: 1k Ohm 0805 SMD resistor; Manufacturer: Vishay; Value: 1 000; Tolerance: 1 %; Rated Power: 0,125 W; Validated: No; Reference: CRCW08051K00FKxx; Footprint description: standard 0805 SMD; Pin Count: 2; helpURL: http://www.vishay.com/docs/20035/dcrcwe3.pdf; Supplier 1: Farnell; Supplier Part Number 1: 1469847; Supplier 2: Mouser; Supplier Part Number 2: 71-CRCW0805-1.0K-E3
R75 R77 R78 = CRCW0805100KFKxx: 100k Ohm 0805 SMD resistor; Manufacturer: Vishay; Value: 100 000; Tolerance: 1 %; Rated Power: 0,125 W; Validated: No; Reference: CRCW0805100KFKxx; Footprint description: standard 0805 SMD; Pin Count: 2; helpURL: http://www.vishay.com/docs/20035/dcrcwe3.pdf; Supplier 1: Farnell; Supplier Part Number 1: 1469860; Supplier 2: Mouser; Supplier Part Number 2: 71-CRCW0805-100K-E3
R76 R79 R80 = CRCW080520K0FKxx: as R44 on sheet OZ440-SE100-CAR003_sheet7; Reference: CRCW080520K0FKxx; Footprint description: standard 0805 SMD; Pin Count: 2; helpURL: http://www.vishay.com/docs/20035/dcrcwe3.pdf; Supplier 1: Farnell; Supplier Part Number 1: 1469893; Supplier 2: Mouser; Supplier Part Number 2: 71-CRCW0805-20K-E3
U16 = DRV8842PWPR: DC MOTOR DRIVER IC; Manufacturer: TI; Max Voltage: 45V; Max Current: 5A; Reference: DRV8842PWPR; Footprint description: TSSOP28 with thermal pad; Pin Count: 28; Rev: 08/2013; helpURL: http://www.ti.com/lit/ds/symlink/drv8842.pdf; Supplier 1: Mouser; Supplier Part Number 1: 595-DRV8842PWP; Supplier 2: Farnell; Supplier Part Number 2: 1903645

## Sheet OZ440-SE100-CAR003_sheet9.SchDoc
size A3
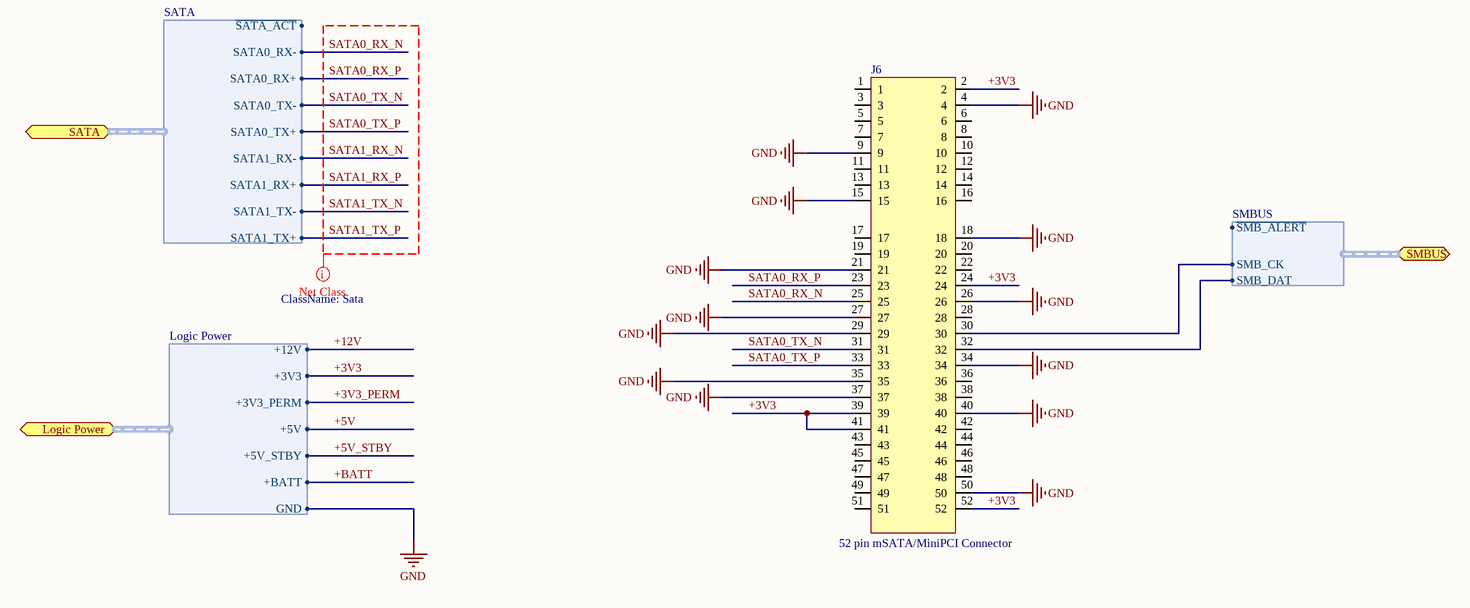
[diagram p8: OZ440-SE100-CAR003_sheet9.SchDoc]

### Parts
J6  Displayed reference: 52 pin mSATA/MiniPCI Connector  [CONN-SPE_MiniPCI-mSATA_MOLEX_67910-0002]  (hidden comment: CONN-STD-miniPCI_msata)

### Ports
Logic Power (harness Logic Power), SATA (harness SATA), SMBUS (harness SMBUS)

### Harnesses
SATA: ~{SATA_ACT}, SATA0_RX-, SATA0_RX+, SATA0_TX-, SATA0_TX+, SATA1_RX-, SATA1_RX+, SATA1_TX-, SATA1_TX+
Logic Power: +12V, +3V3, +3V3_PERM, +5V, +5V_STBY, +BATT, GND
SMBUS: ~{SMB_ALERT}, SMB_CK, SMB_DAT

### Nets
+3V3: J6.2 J6.24 J6.39 J6.41 J6.52 ; port Logic Power.+3V3
+5V: port Logic Power.+5V, port Logic Power.+5V_STBY  [also labelled +5V_STBY]
GND: J6.4 J6.9 J6.15 J6.18 J6.21 J6.26 J6.27 J6.29 J6.34 J6.35 J6.37 J6.40 J6.50 ; port Logic Power.GND  [project net Logic_Power.GND]
SATA0_RX_N: J6.25 ; port SATA.SATA0_RX-
SATA0_RX_P: J6.23 ; port SATA.SATA0_RX+
SATA0_TX_N: J6.31 ; port SATA.SATA0_TX-
SATA0_TX_P: J6.33 ; port SATA.SATA0_TX+
SMB_CK: J6.30 ; port SMBUS.SMB_CK
SMB_DAT: J6.32 ; port SMBUS.SMB_DAT

Not connected (* = marked no-connect by the designer): J6 1 3 5 6 7 8 10 11 12 13 14 16 17 19 20 22 28 36 38 42 43 44 45 46 47 48 49 51

### Layout directives
net class Sata: SATA0_RX_N, SATA0_RX_P, SATA0_TX_N, SATA0_TX_P, SATA1_RX_N, SATA1_RX_P, SATA1_TX_N, SATA1_TX_P

### Notes on the sheet
- Titre document:
- NAIO TECHNOLOGIES
- 3 Av didier Daurat
- 31400 TOULOUSE
- Auteur:
- Numéro document:
- Verificateur:
- Format:
- A3
- Date:
- Revision:
- Page:
- /

### Library data of the parts
J6 = 67910-0002: miniPCI / mSATA connector; Manufacturer: MOLEX; Validated: False; Reference: 67910-0002; Footprint description: 52 pin SMD, 0.8mm pitch; Pin Count: 52; Rev: C; helpURL: http://www.farnell.com/datasheets/70912.pdf; Supplier 1: Farnell; Supplier Part Number 1: 1394481; Supplier 2: Mouser; Supplier Part Number 2: 538-67910-0002

## Sheet OZ440-SE100-CAR003_sheet10.SchDoc
size A3
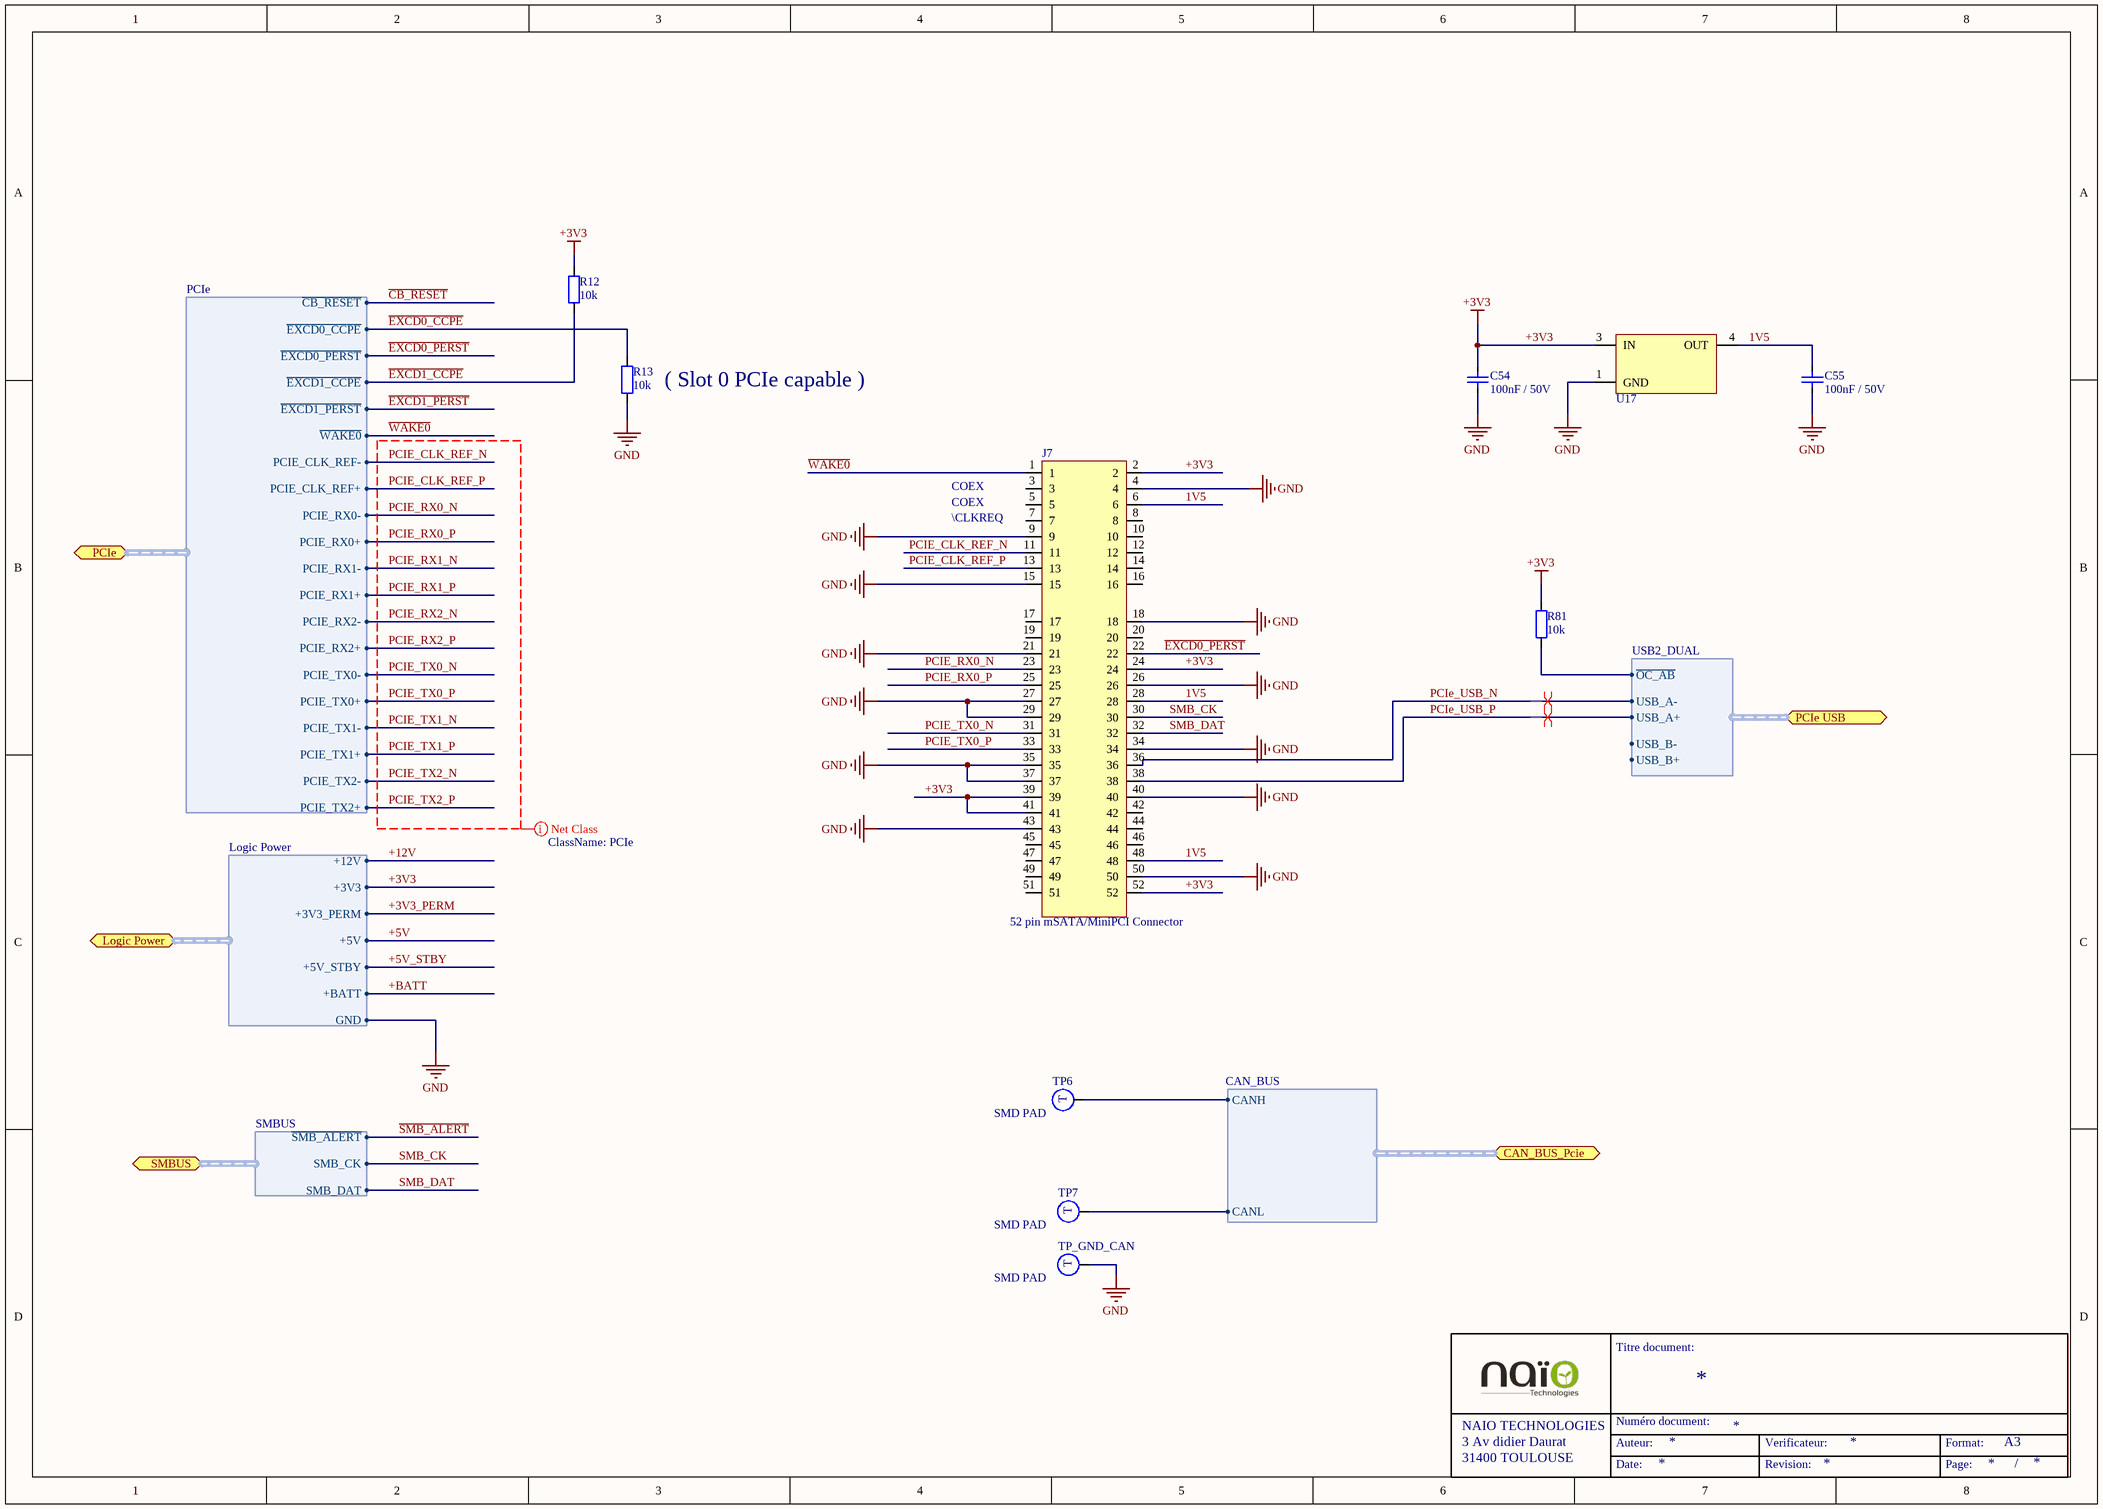
[diagram p9: OZ440-SE100-CAR003_sheet10.SchDoc]

### Parts
C54  Displayed reference: 100nF / 50V  [C0805-STD]  (hidden comment: CAP-SMD)
C55  Displayed reference: 100nF / 50V  [C0805-STD]  (hidden comment: CAP-SMD)
J7  Displayed reference: 52 pin mSATA/MiniPCI Connector  [CONN-SPE_MiniPCI-mSATA_MOLEX_67910-0002]  (hidden comment: CONN-STD-miniPCI_msata)
R12  Displayed reference: 10k  [R0805-STD]  (hidden comment: RES-SMD)
R13  Displayed reference: 10k  [R0805-STD]  (hidden comment: RES-SMD)
R81  Displayed reference: 10k  [R0805-STD]  (hidden comment: RES-SMD)
TP6  Displayed reference: SMD PAD  [MEC-STD-SMD_PAD_2mm]  (hidden comment: TP-STD-TEST_POINT)  (no BOM)
TP7  Displayed reference: SMD PAD  [MEC-STD-SMD_PAD_2mm]  (hidden comment: TP-STD-TEST_POINT)  (no BOM)
TP_GND_CAN  Displayed reference: SMD PAD  [MEC-STD-SMD_PAD_2mm]  (hidden comment: TP-STD-TEST_POINT)  (no BOM)
U17  NCP1117-DPAK  [DPAK-STD]  (value not drawn)

### Ports
CAN_BUS_Pcie (harness CAN_BUS), Logic Power (harness Logic Power), PCIe (harness PCIe), PCIe USB (harness USB2_DUAL), SMBUS (harness SMBUS)

### Harnesses
PCIe: ~{CB_RESET}, ~{EXCD0_CCPE}, ~{EXCD0_PERST}, ~{EXCD1_CCPE}, ~{EXCD1_PERST}, ~{WAKE0}, PCIE_CLK_REF-, PCIE_CLK_REF+, PCIE_RX0-, PCIE_RX0+, PCIE_RX1-, PCIE_RX1+, PCIE_RX2-, PCIE_RX2+, PCIE_TX0-, PCIE_TX0+, PCIE_TX1-, PCIE_TX1+, PCIE_TX2-, PCIE_TX2+
Logic Power: +12V, +3V3, +3V3_PERM, +5V, +5V_STBY, +BATT, GND
SMBUS: ~{SMB_ALERT}, SMB_CK, SMB_DAT
USB2_DUAL: ~{OC_AB}, USB_A-, USB_A+, USB_B-, USB_B+
CAN_BUS: CANH, CANL

### Nets
+3V3: C54.2 J7.2 J7.24 J7.39 J7.41 J7.52 R12.1 R81.1 U17.3(IN) ; port Logic Power.+3V3
+5V: port Logic Power.+5V, port Logic Power.+5V_STBY  [also labelled +5V_STBY]
GND: C54.1 C55.1 J7.4 J7.9 J7.15 J7.18 J7.21 J7.26 J7.27 J7.29 J7.34 J7.35 J7.37 J7.40 J7.43 J7.50 R13.2 TP_GND_CAN.1(T) U17.1(GND) ; port Logic Power.GND  [project net Logic_Power.GND]
1V5: C55.2 J7.6 J7.28 J7.48 U17.4(OUT)
~{EXCD0_CCPE}: R13.1 ; port PCIe.~{EXCD0_CCPE}
~{EXCD0_PERST}: J7.22 ; port PCIe.~{EXCD0_PERST}
~{EXCD1_CCPE}: R12.2 ; port PCIe.~{EXCD1_CCPE}
~{OC_2_3}: R81.2 ; port PCIe USB.~{OC_AB}
~{WAKE0}: J7.1 ; port PCIe.~{WAKE0}
CAN_bus.CANH: TP6.1(T) ; port CAN_BUS_Pcie.CANH
CAN_bus.CANL: TP7.1(T) ; port CAN_BUS_Pcie.CANL
PCIE_CLK_REF_N: J7.11 ; port PCIe.PCIE_CLK_REF-
PCIE_CLK_REF_P: J7.13 ; port PCIe.PCIE_CLK_REF+
PCIE_RX0_N: J7.23 ; port PCIe.PCIE_RX0-
PCIE_RX0_P: J7.25 ; port PCIe.PCIE_RX0+
PCIE_TX0_N: J7.31 ; port PCIe.PCIE_TX0-
PCIE_TX0_P: J7.33 ; port PCIe.PCIE_TX0+
PCIe_USB_N: J7.36 ; port PCIe USB.USB_A-
PCIe_USB_P: J7.38 ; port PCIe USB.USB_A+
SMB_CK: J7.30 ; port SMBUS.SMB_CK
SMB_DAT: J7.32 ; port SMBUS.SMB_DAT

Not connected (* = marked no-connect by the designer): J7 3 5 7 8 10 12 14 16 17 19 20 42 44 45 46 47 49 51

### Layout directives
net class PCIe: PCIE_CLK_REF_N, PCIE_CLK_REF_P, PCIE_RX0_N, PCIE_RX0_P, PCIE_RX1_N, PCIE_RX1_P, PCIE_RX2_N, PCIE_RX2_P, PCIE_TX0_N, PCIE_TX0_P, PCIE_TX1_N, PCIE_TX1_P, PCIE_TX2_N, PCIE_TX2_P
differential pair: PCIe_USB_N, PCIe_USB_P

### Notes on the sheet
- (near R13) ( Slot 0 PCIe capable )
- COEX
- (near J7) \CLKREQ
- Titre document:
- NAIO TECHNOLOGIES
- 3 Av didier Daurat
- 31400 TOULOUSE
- Auteur:
- Numéro document:
- Verificateur:
- Format:
- A3
- Date:
- Revision:
- Page:
- /

### Library data of the parts
C54 C55 = VJ0805Y104KXAxx: as C44 on sheet OZ440-SE100-CAR003_sheet8; Reference: VJ0805Y104KXAxx; Value: 100nF; Material: X7R; Footprint description: standard Capacitor 0805; Pin Count: 2; helpURL: http://www.vishay.com/docs/45200/highrels.pdf; Supplier 1: Farnell; Supplier Part Number 1: 1612208; Supplier 2: Digi-Key; Supplier Part Number 2: 720-1266-6-ND
J7 = 67910-0002: as J6 on sheet OZ440-SE100-CAR003_sheet9; Reference: 67910-0002; Footprint description: 52 pin SMD, 0.8mm pitch; Pin Count: 52; Rev: C; helpURL: http://www.farnell.com/datasheets/70912.pdf; Supplier 1: Farnell; Supplier Part Number 1: 1394481; Supplier 2: Mouser; Supplier Part Number 2: 538-67910-0002
R12 R13 R81 = CRCW080510K0FKxx: as R42 on sheet OZ440-SE100-CAR003_sheet7; Reference: CRCW080510K0FKxx; Footprint description: standard 0805 SMD; Pin Count: 2; helpURL: http://www.vishay.com/docs/20035/dcrcwe3.pdf; Supplier 1: Farnell; Supplier Part Number 1: 1469856; Supplier 2: Mouser; Supplier Part Number 2: 71-CRCW0805-10K-E3
TP6 TP7 TP_GND_CAN = SMD Pad: SMD Pad for wire soldering; Validated: False; Reference: SMD Pad; Footprint description: Smd pad; Pin Count: 1
U17 = NCP1117DT15RKG: 1.0 A Low-Dropout Positive Voltage Regulators; Manufacturer: On semi; Displayed reference: NCP1117-1.5V; Max Voltage: 20V; Max Current: 1A; Reference: NCP1117DT15RKG; Footprint description: DPAK; Pin Count: 3; Rev: 27; helpURL: http://www.onsemi.com/pub_link/Collateral/NCP1117-D.PDF; Supplier 1: Mouser; Supplier Part Number 1: 863-NCP1117DT15RKG; Supplier 2: Farnell; Supplier Part Number 2: 1221453

## Sheet OZ440-SE100-CAR003_sheet11.SchDoc
size A3
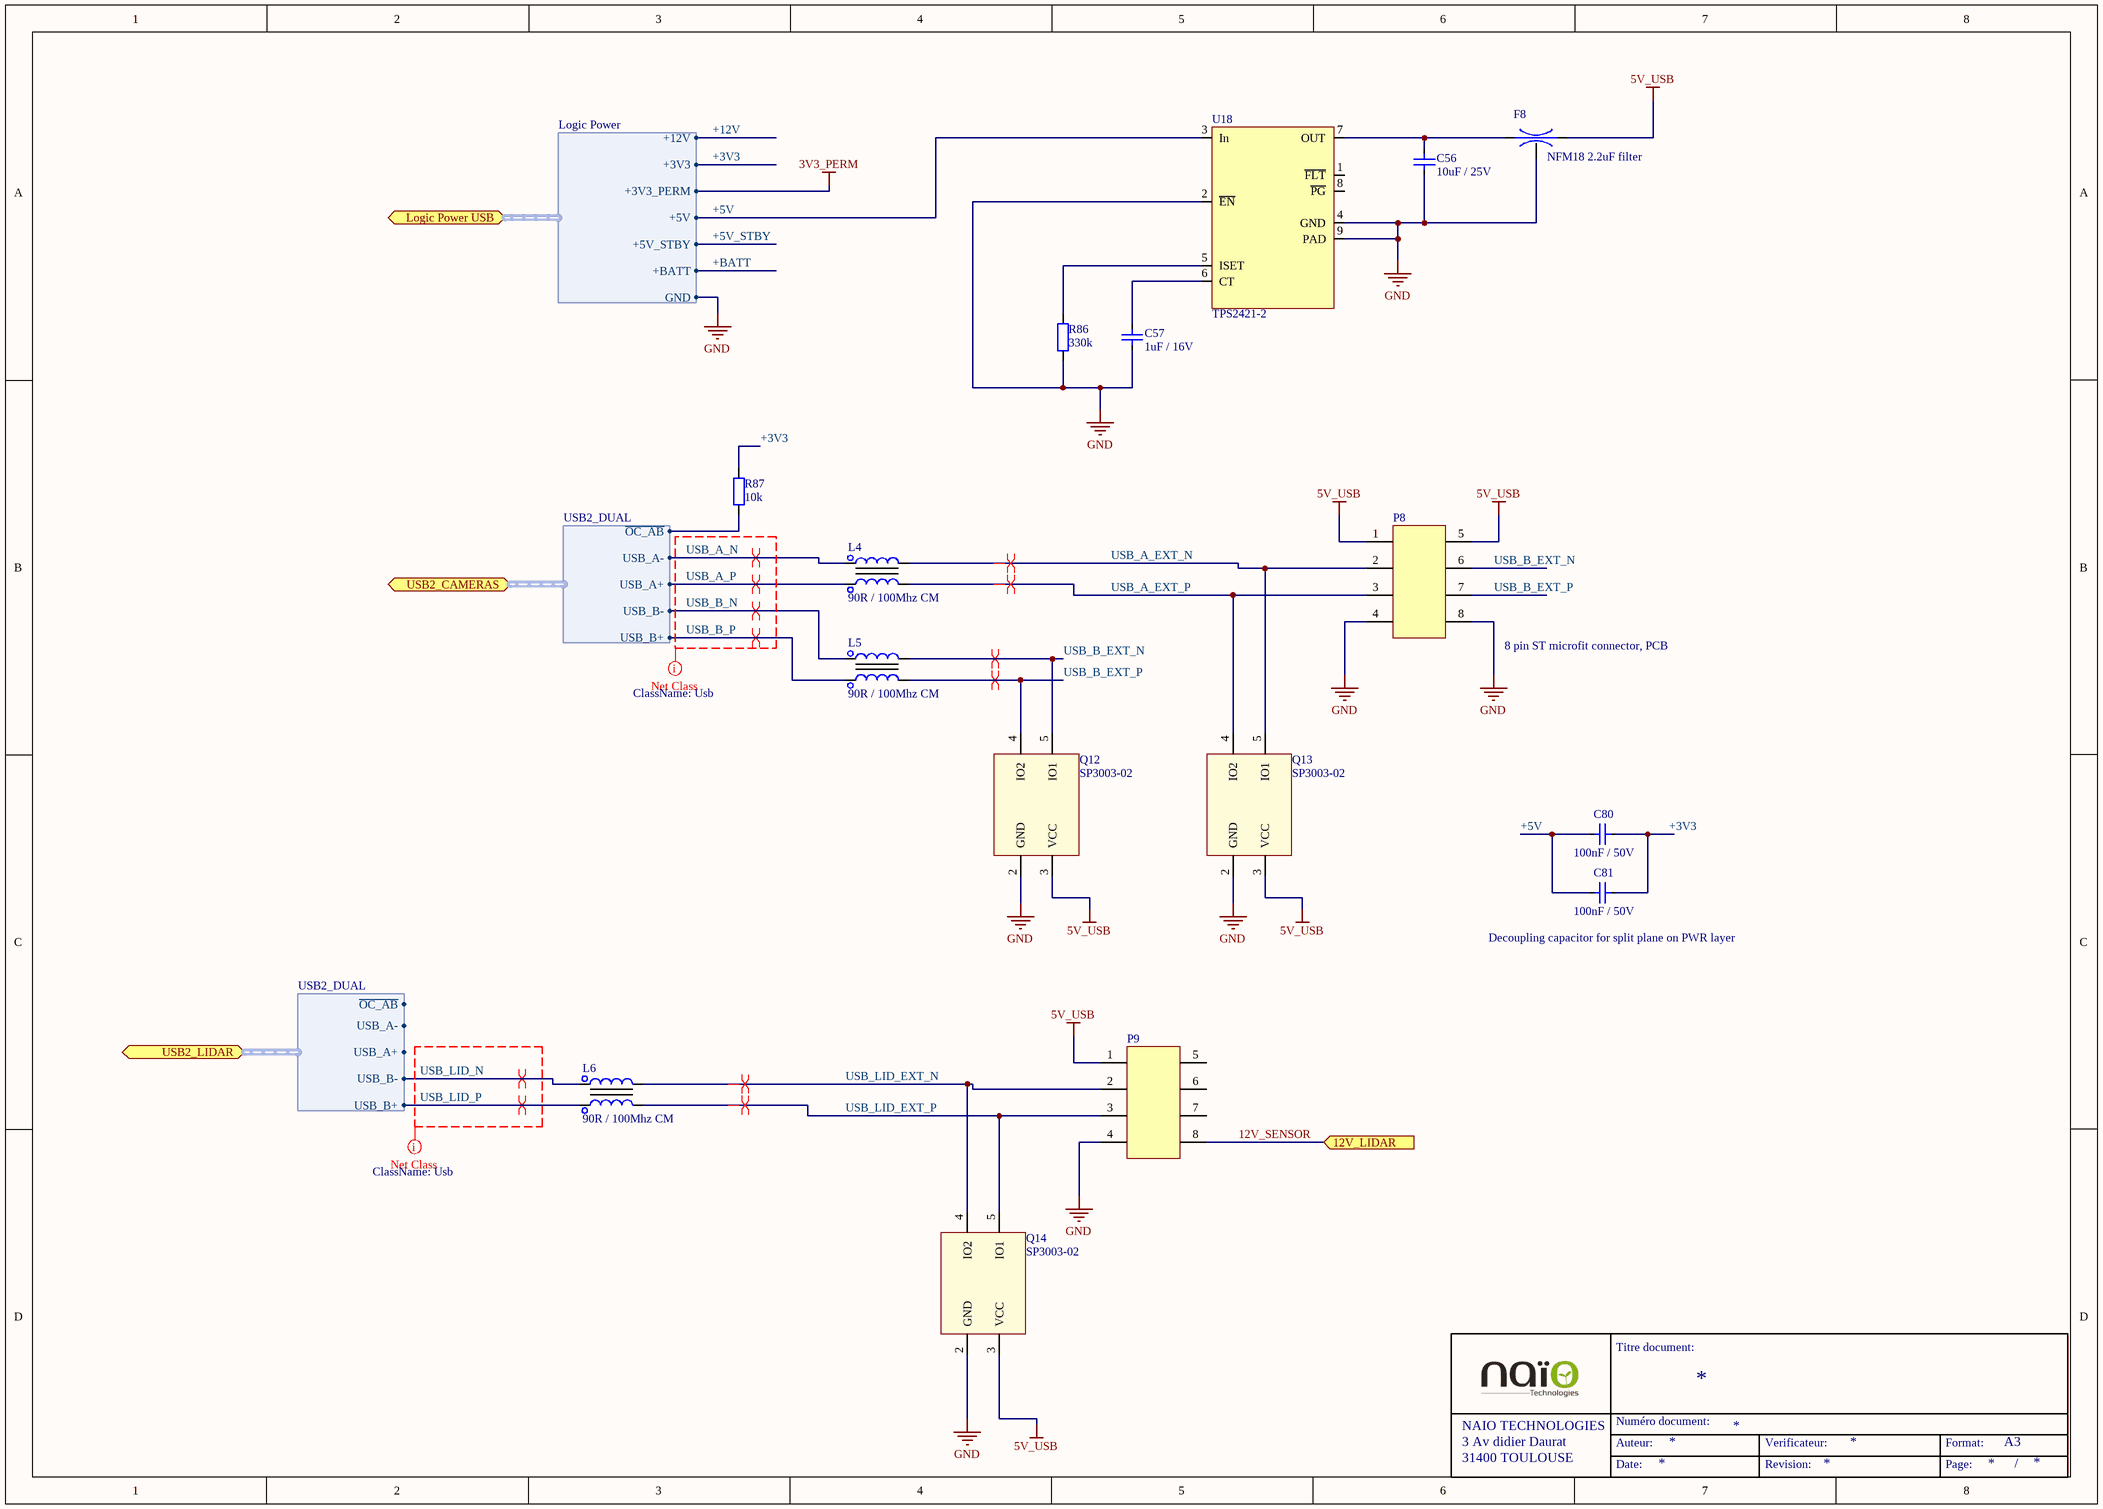
[diagram p10: OZ440-SE100-CAR003_sheet11.SchDoc]

### Parts
C56  Displayed reference: 10uF / 25V  [C1206-STD]  (hidden comment: CAP-SMD)
C57  Displayed reference: 1uF / 16V  [C0805-STD]  (hidden comment: CAP-SMD)
C80  Displayed reference: 100nF / 50V  [C0805-STD]  (hidden comment: CAP-SMD)
C81  Displayed reference: 100nF / 50V  [C0805-STD]  (hidden comment: CAP-SMD)
F8  Displayed reference: NFM18 2.2uF filter  [LC_0603-STD]  (hidden comment: LC_FILTER-STD)
L4  Displayed reference: 90R / 100Mhz CM  [L-SPE-0805_MC_EXC34]  (hidden comment: IND-MC-SMD)
L5  Displayed reference: 90R / 100Mhz CM  [L-SPE-0805_MC_EXC34]  (hidden comment: IND-MC-SMD)
L6  Displayed reference: 90R / 100Mhz CM  [L-SPE-0805_MC_EXC34]  (hidden comment: IND-MC-SMD)
P8  Displayed reference: 8 pin ST microfit connector, PCB  [CONN-SPE_MOLEX_43045-0812]  (hidden comment: CONN-SPE-8P_MOLEX_43045-0801)
P9  CONN-SPE-8P_MOLEX_43045-0801  [CONN-SPE_MOLEX_43045-0812]  (value not drawn)
Q12  Displayed reference: SP3003-02  [SC70-SPE-SP3003]  (hidden comment: SP03003_02-SC70)
Q13  Displayed reference: SP3003-02  [SC70-SPE-SP3003]  (hidden comment: SP03003_02-SC70)
Q14  Displayed reference: SP3003-02  [SC70-SPE-SP3003]  (hidden comment: SP03003_02-SC70)
R86  Displayed reference: 330k  [R0805-STD]  (hidden comment: RES-SMD)
R87  Displayed reference: 10k  [R0805-STD]  (hidden comment: RES-SMD)
U18  Displayed reference: TPS2421-2  [SO8_THERMAL-STD]  (hidden comment: TPS2421-SO8)

### Ports
12V_LIDAR (in), Logic Power USB (harness Logic Power), USB2_CAMERAS (harness USB2_DUAL), USB2_LIDAR (harness USB2_DUAL)

### Harnesses
Logic Power: +12V, +3V3, +3V3_PERM, +5V, +5V_STBY, +BATT, GND
USB2_DUAL: ~{OC_AB}, USB_A-, USB_A+, USB_B-, USB_B+
USB2_DUAL: USB_A-, USB_A+, USB_B-, USB_B+, ~{OC_AB}

### Nets
5V_USB: F8.2(B) P8.1 P8.5 P9.1 Q12.3(VCC) Q13.3(VCC) Q14.3(VCC)
12V_SENSOR: P9.8 ; port 12V_LIDAR
+3V3: C80.1 C81.1 R87.1 ; port Logic Power USB.+3V3
+5V: C80.2 C81.2 U18.3(In) ; port Logic Power USB.+5V, port Logic Power USB.+5V_STBY  [also labelled +5V_STBY]
GND: C56.1 C57.1 F8.3(G) P8.4 P8.8 P9.4 Q12.2(GND) Q13.2(GND) Q14.2(GND) R86.1 U18.2(~{EN}) U18.4(GND) U18.9(PAD) ; port Logic Power USB.GND  [project net Logic_Power.GND]
~{OC_0_1}: R87.2 ; port USB2_CAMERAS.~{OC_AB}
USB_A_EXT_N: L4.2 P8.2 Q13.5(IO1)
USB_A_EXT_P: L4.3 P8.3 Q13.4(IO2)
USB_A_N: L4.1 ; port USB2_CAMERAS.USB_A-  [project net USB0_N]
USB_A_P: L4.4 ; port USB2_CAMERAS.USB_A+  [project net USB0_P]
USB_B_EXT_N: L5.2 P8.6 Q12.5(IO1)
USB_B_EXT_P: L5.3 P8.7 Q12.4(IO2)
USB_B_N: L5.1 ; port USB2_CAMERAS.USB_B-  [project net USB1_N]
USB_B_P: L5.4 ; port USB2_CAMERAS.USB_B+  [project net USB1_P]
USB_LID_EXT_N: L6.2 P9.2 Q14.4(IO2)
USB_LID_EXT_P: L6.3 P9.3 Q14.5(IO1)
USB_LID_N: L6.1 ; port USB2_LIDAR.USB_B-  [project net USB3_N]
USB_LID_P: L6.4 ; port USB2_LIDAR.USB_B+  [project net USB3_P]
NetC56_2: C56.2 F8.1(A) U18.7(OUT)
NetC57_2: C57.2 U18.6(CT)
NetR86_2: R86.2 U18.5(ISET)

Not connected (* = marked no-connect by the designer): P9 5(9) 6 7; U18 1(~{FLT}) 8(~{PG})

### Layout directives
differential pair: USB0_N, USB0_P, USB1_N, USB1_P, USB3_N, USB3_P, USB_A_EXT_N, USB_A_EXT_P, USB_B_EXT_N, USB_B_EXT_P, USB_LID_EXT_N, USB_LID_EXT_P
net class Usb: USB_A_N, USB_A_P, USB_B_N, USB_B_P, USB_LID_N, USB_LID_P

### Notes on the sheet
- (near C81) Decoupling capacitor for split plane on PWR layer
- Titre document:
- NAIO TECHNOLOGIES
- 3 Av didier Daurat
- 31400 TOULOUSE
- Auteur:
- Numéro document:
- Verificateur:
- Format:
- A3
- Date:
- Revision:
- Page:
- /

### Library data of the parts
C56 = C1206C106K3RACxx: as C38 on sheet OZ440-SE100-CAR003_sheet7; Reference: C1206C106K3RACxx; Value: 10uF; Material: X7R; Footprint description: standard Capacitor 1206; Pin Count: 2; helpURL: http://www.farnell.com/datasheets/1444528.pdf; Supplier 1: Farnell; Supplier Part Number 1: 2118134; Supplier 2: Digi-Key; Supplier Part Number 2: 399-7442-1-ND
C57 = C0805C105K4RACxx: as C39 on sheet OZ440-SE100-CAR003_sheet7; Reference: C0805C105K4RACxx; Value: 1uF; Material: X7R; Footprint description: standard Capacitor 0805; Pin Count: 2; helpURL: http://www.farnell.com/datasheets/40863.pdf; Supplier 1: Farnell; Supplier Part Number 1: 9227792; Supplier 2: Digi-Key; Supplier Part Number 2: 399-6930-1-ND
C80 C81 = VJ0805Y104KXAxx: as C44 on sheet OZ440-SE100-CAR003_sheet8; Reference: VJ0805Y104KXAxx; Value: 100nF; Material: X7R; Footprint description: standard Capacitor 0805; Pin Count: 2; helpURL: http://www.vishay.com/docs/45200/highrels.pdf; Supplier 1: Farnell; Supplier Part Number 1: 1612208; Supplier 2: Digi-Key; Supplier Part Number 2: 720-1266-6-ND
F8 = NFM18PC225B0J3: as F7 on sheet OZ440-SE100-CAR003_sheet7; Reference: NFM18PC225B0J3; Max Current: 2A; Footprint description: standard 0603 filter package; Pin Count: 3; Rev: 2/11/2011; helpURL: http://www.murata.com/products/emc/application/pdf/EMIAPDCE_2.pdf; Supplier 1: Digi-Key; Supplier Part Number 1: NFM18PC225B0J3D-ND; Supplier 2: Mouser; Supplier Part Number 2: 81-NFM18PC225B0J3D
L4-L6 = EXC34CE900: USB common mode inductor; Manufacturer: PANASONIC; Max Current: 0.25A; Validated: False; Reference: EXC34CE900; Footprint description: SMD 4 pin; Pin Count: 4; Rev: 11/2012; helpURL: http://www.farnell.com/datasheets/1790924.pdf; Supplier 1: Farnell; Supplier Part Number 1: 1893883; Supplier 2: Mouser; Supplier Part Number 2: 667-EXC-34CE900U
P8 P9 = 43045-0812: as P7 on sheet OZ440-SE100-CAR003_sheet8; Reference: 43045-0812; Footprint description: 8 pin SMT connector ST, TH; Pin Count: 8; Rev: G; helpURL: http://www.molex.com/pdm_docs/sd/430450812_sd.pdf
Q12-Q14 = SP3003-02JTG: Low capacitance ESD TVS; Manufacturer: LITTLEFUSE; Max Voltage: 8V; Reference: SP3003-02JTG; component type: DIODE; Footprint description: SC70; Pin Count: 5; Rev: 20/08/13; helpURL: http://www.littelfuse.com/~/media/electronics/datasheets/tvs_diode_arrays/littelfuse_tvs_diode_array_sp3003_datasheet.pdf.pdf; Supplier 1: Farnell; Supplier Part Number 1: 2369568; Supplier 2: Mouser; Supplier Part Number 2: 576-SP3003-02JTG
R86 = CRCW0805330KFKxx: 330k Ohm 0805 SMD resistor; Manufacturer: Vishay; Value: 330 000; Tolerance: 1%; Rated Power: 0.125W; Validated: False; Reference: CRCW0805330KFKxx; Footprint description: standard 0805 SMD; Pin Count: 2; helpURL: http://www.vishay.com/docs/20035/dcrcwe3.pdf; Supplier 1: Farnell; Supplier Part Number 1: 2123444; Supplier 2: Mouser; Supplier Part Number 2: 71-CRCW0805330KFKEA
R87 = CRCW080510K0FKxx: as R42 on sheet OZ440-SE100-CAR003_sheet7; Reference: CRCW080510K0FKxx; Footprint description: standard 0805 SMD; Pin Count: 2; helpURL: http://www.vishay.com/docs/20035/dcrcwe3.pdf; Supplier 1: Farnell; Supplier Part Number 1: 1469856; Supplier 2: Mouser; Supplier Part Number 2: 71-CRCW0805-10K-E3
U18 = TPS2421-2DDA: as U15 on sheet OZ440-SE100-CAR003_sheet7; Reference: TPS2421-2DDA; Footprint description: SO8 with thermal PAD; Pin Count: 8; Rev: 01/14; helpURL: http://www.ti.com/lit/ds/symlink/tps2421-1.pdf; Supplier 1: Mouser; Supplier Part Number 1: 595-TPS2421-2DDA; Supplier 2: Farnell; Supplier Part Number 2: 2323674

## Sheet OZ440-SE100-CAR003_sheet12.SchDoc
size A3
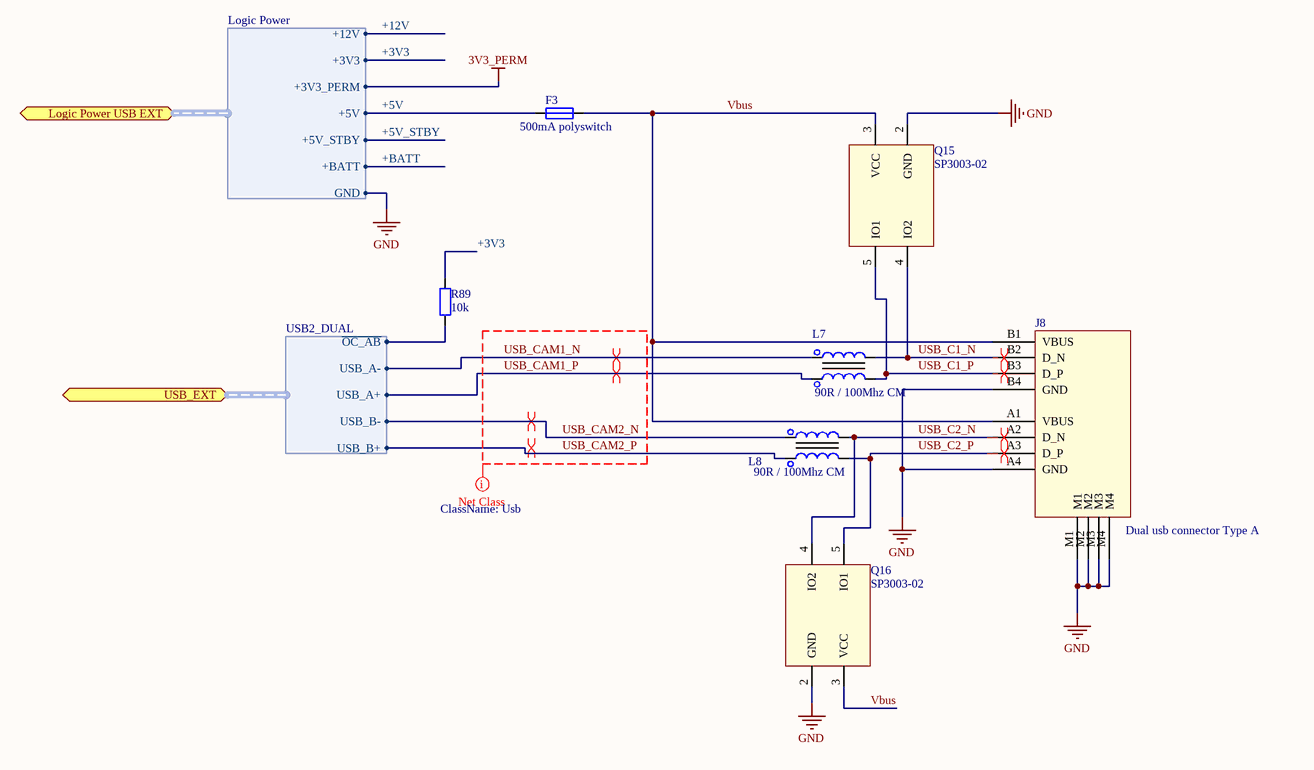
[diagram p11: OZ440-SE100-CAR003_sheet12.SchDoc]

### Parts
F3  Displayed reference: 500mA polyswitch  [R0805-STD]  (hidden comment: FUSE-SMD)
J8  Displayed reference: Dual usb connector Type A  [CONN-STD-USB_A]  (hidden comment: CONN-STD_USB_A_DUAL)
L7  Displayed reference: 90R / 100Mhz CM  [L-SPE-0805_MC_EXC34]  (hidden comment: IND-MC-SMD)
L8  Displayed reference: 90R / 100Mhz CM  [L-SPE-0805_MC_EXC34]  (hidden comment: IND-MC-SMD)
Q15  Displayed reference: SP3003-02  [SC70-SPE-SP3003]  (hidden comment: SP03003_02-SC70)
Q16  Displayed reference: SP3003-02  [SC70-SPE-SP3003]  (hidden comment: SP03003_02-SC70)
R89  Displayed reference: 10k  [R0805-STD]  (hidden comment: RES-SMD)

### Ports
Logic Power USB EXT (harness Logic Power), USB_EXT (harness USB2_DUAL)

### Harnesses
USB2_DUAL: ~{OC_AB}, USB_A-, USB_A+, USB_B-, USB_B+
Logic Power: +12V, +3V3, +3V3_PERM, +5V, +5V_STBY, +BATT, GND

### Nets
+3V3: R89.2 ; port Logic Power USB EXT.+3V3
+5V: F3.1 ; port Logic Power USB EXT.+5V, port Logic Power USB EXT.+5V_STBY  [also labelled +5V_STBY]
GND: J8.A4(GND) J8.B4(GND) J8.M1 J8.M2 J8.M3 J8.M4 Q15.2(GND) Q16.2(GND) ; port Logic Power USB EXT.GND  [project net Logic_Power.GND]
~{OC_4_5}: R89.1 ; port USB_EXT.~{OC_AB}
USB_C1_N: J8.B2(D_N) L7.2 Q15.4(IO2)
USB_C1_P: J8.B3(D_P) L7.3 Q15.5(IO1)
USB_C2_N: J8.A2(D_N) L8.2 Q16.4(IO2)
USB_C2_P: J8.A3(D_P) L8.3 Q16.5(IO1)
USB_CAM1_N: L7.1 ; port USB_EXT.USB_A-  [project net USB4_N]
USB_CAM1_P: L7.4 ; port USB_EXT.USB_A+  [project net USB4_P]
USB_CAM2_N: L8.1 ; port USB_EXT.USB_B-  [project net USB5_N]
USB_CAM2_P: L8.4 ; port USB_EXT.USB_B+  [project net USB5_P]
Vbus: F3.2 J8.A1(VBUS) J8.B1(VBUS) Q15.3(VCC) Q16.3(VCC)

### Layout directives
differential pair: USB4_N, USB4_P, USB5_N, USB5_P, USB_C1_N, USB_C1_P, USB_C2_N, USB_C2_P
net class Usb: USB_CAM1_N, USB_CAM1_P, USB_CAM2_N, USB_CAM2_P

### Notes on the sheet
- Titre document:
- NAIO TECHNOLOGIES
- 3 Av didier Daurat
- 31400 TOULOUSE
- Auteur:
- Numéro document:
- Verificateur:
- Format:
- A3
- Date:
- Revision:
- Page:
- /

### Library data of the parts
F3 = MF-PSMF050X-2: as F2 on sheet OZ440-SE100-CAR003_sheet8; Reference: MF-PSMF050X-2; Max Current: 500mA; Pin Count: 2; helpURL: http://www.farnell.com/datasheets/1442129.pdf; Supplier 1: Farnell; Supplier Part Number 1: 1294876; Supplier 2: Mouser; Supplier Part Number 2: 652-MF-PSMF050X-2
J8 = 72309-8044BLF: Dual USB Type A connector; Manufacturer: FCI; Validated: False; Reference: 72309-8044BLF; Footprint description: Dual USB type A; Pin Count: 8; Rev: AJ; helpURL: http://portal.fciconnect.com/Comergent//fci/drawing/72309.pdf; Supplier 1: Mouser; Supplier Part Number 1: 649-72309-8044BLF; Supplier 2: Farnell; Supplier Part Number 2: 1835462
L7 L8 = EXC34CE900: as L4 on sheet OZ440-SE100-CAR003_sheet11; Reference: EXC34CE900; Footprint description: SMD 4 pin; Pin Count: 4; Rev: 11/2012; helpURL: http://www.farnell.com/datasheets/1790924.pdf; Supplier 1: Farnell; Supplier Part Number 1: 1893883; Supplier 2: Mouser; Supplier Part Number 2: 667-EXC-34CE900U
Q15 Q16 = SP3003-02JTG: as Q12 on sheet OZ440-SE100-CAR003_sheet11; Reference: SP3003-02JTG; component type: DIODE; Footprint description: SC70; Pin Count: 5; Rev: 20/08/13; helpURL: http://www.littelfuse.com/~/media/electronics/datasheets/tvs_diode_arrays/littelfuse_tvs_diode_array_sp3003_datasheet.pdf.pdf; Supplier 1: Farnell; Supplier Part Number 1: 2369568; Supplier 2: Mouser; Supplier Part Number 2: 576-SP3003-02JTG
R89 = CRCW080510K0FKxx: as R42 on sheet OZ440-SE100-CAR003_sheet7; Reference: CRCW080510K0FKxx; Footprint description: standard 0805 SMD; Pin Count: 2; helpURL: http://www.vishay.com/docs/20035/dcrcwe3.pdf; Supplier 1: Farnell; Supplier Part Number 1: 1469856; Supplier 2: Mouser; Supplier Part Number 2: 71-CRCW0805-10K-E3